# EAGLE design BenchTopPowerSupply (EAGLE 9.6.2)
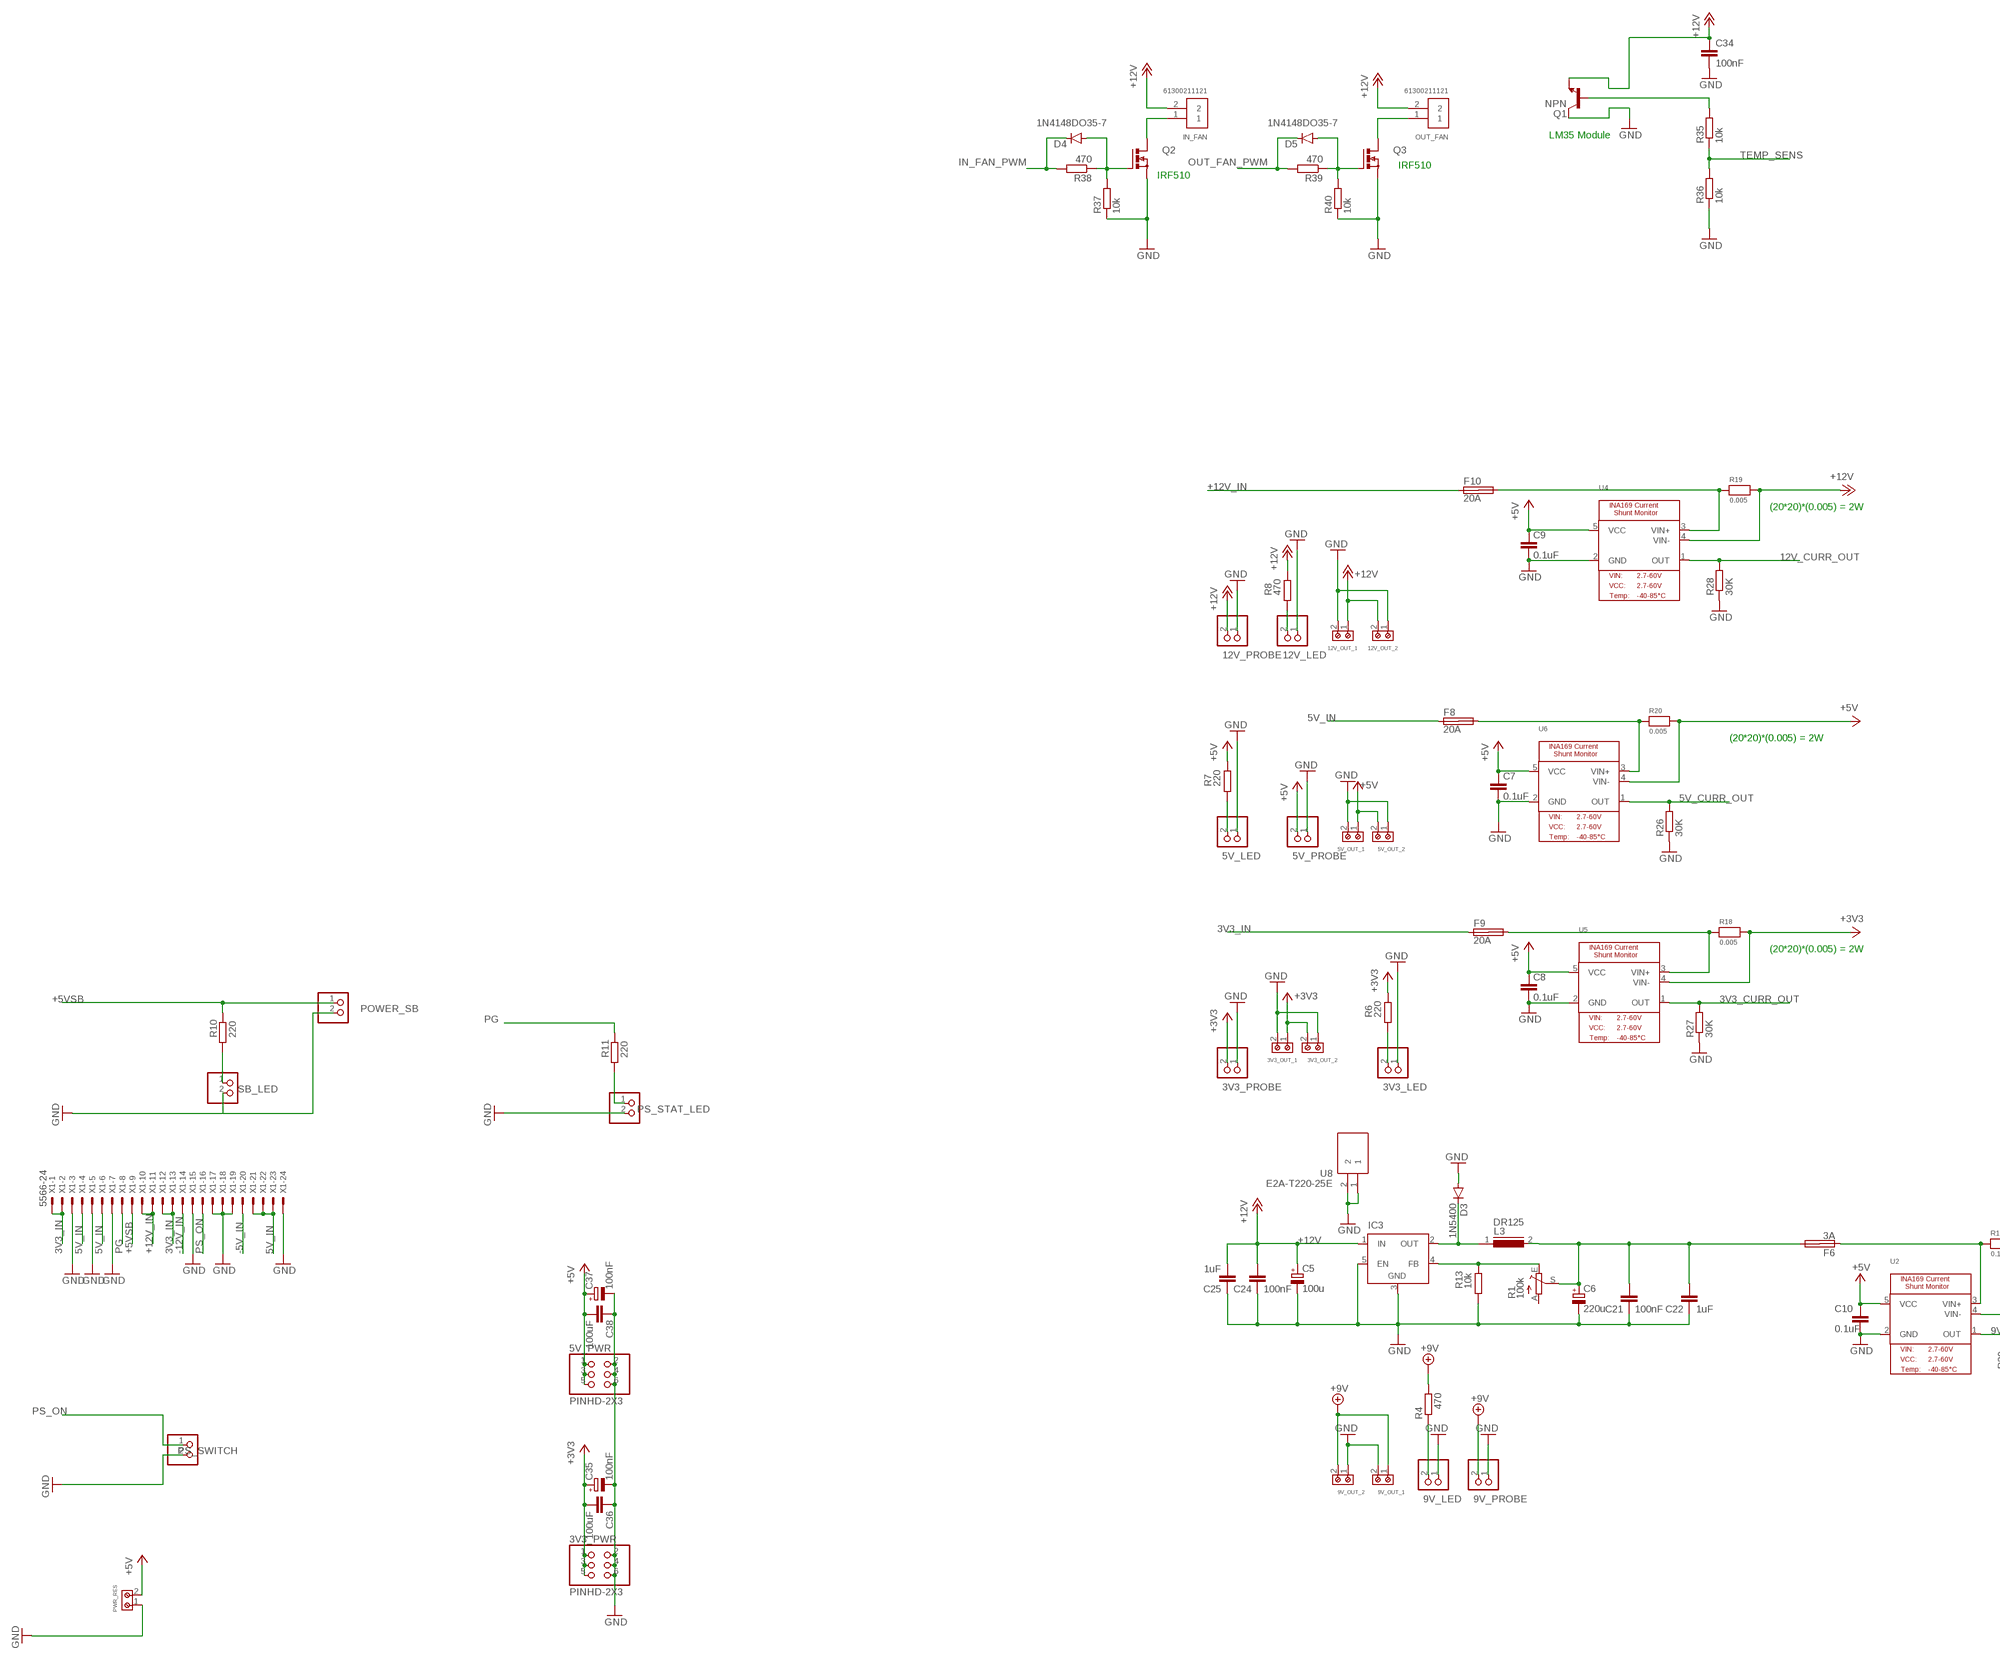
[diagram p0: schematic, sheet 1, part 1 of 2]
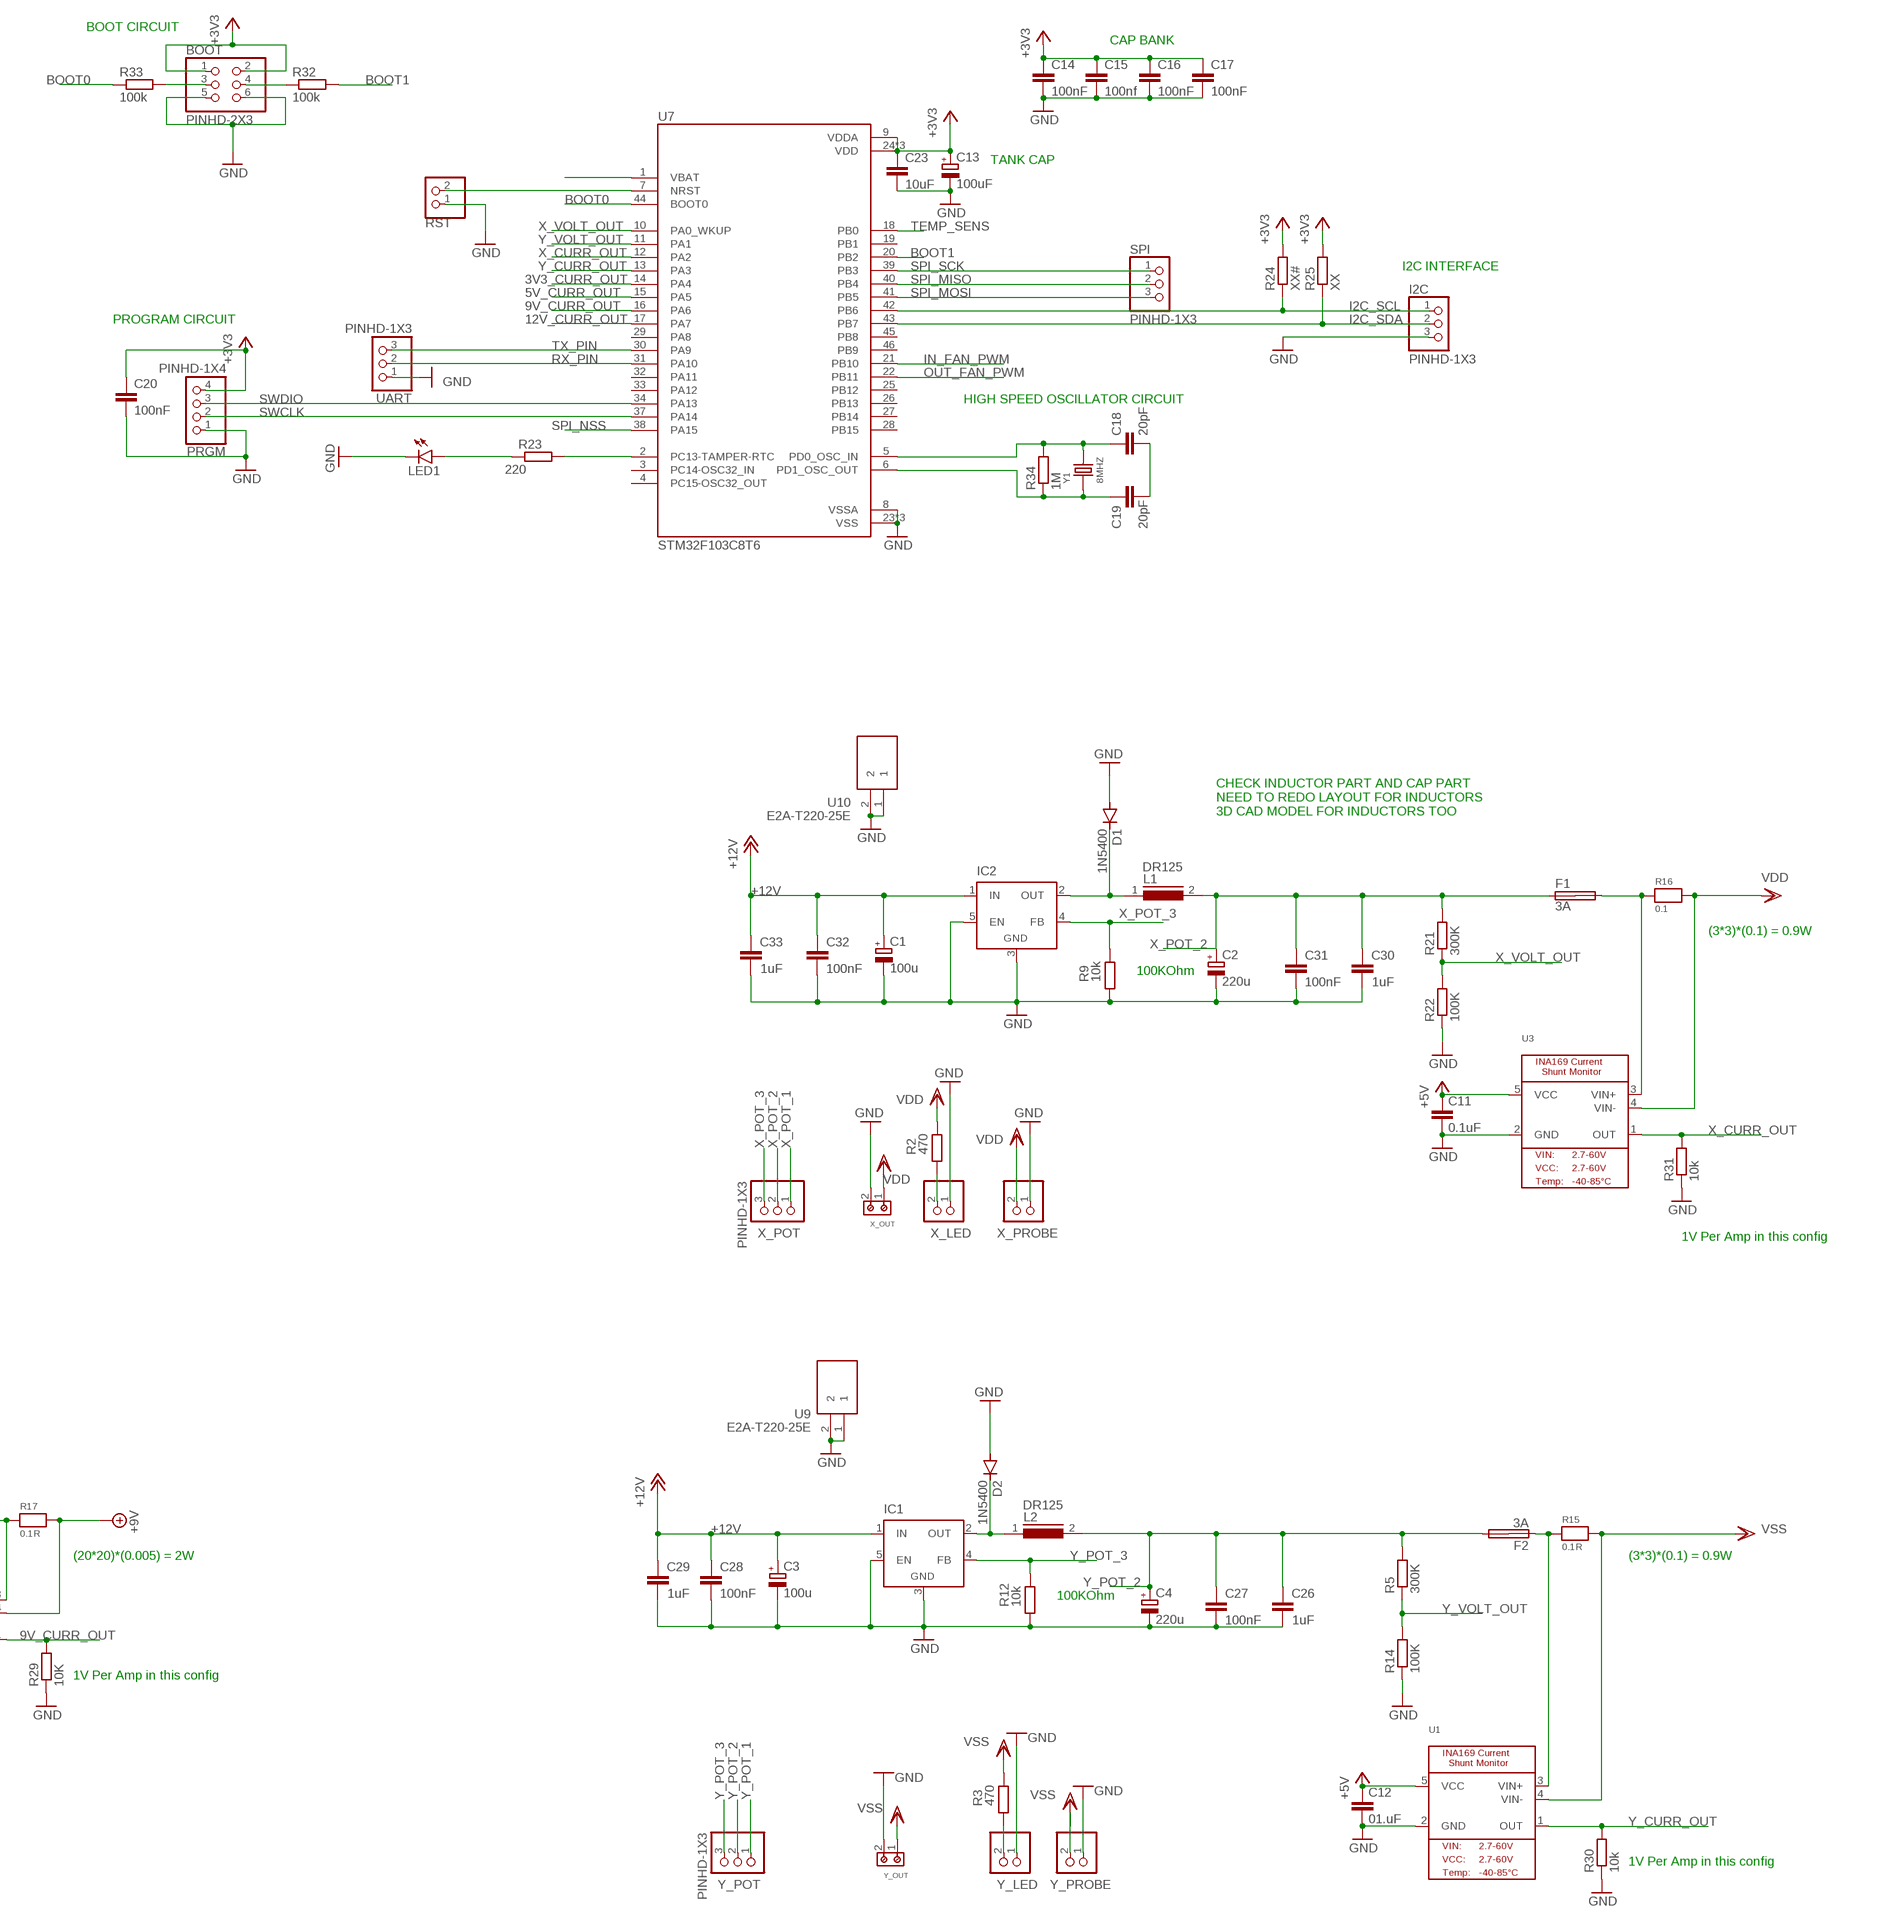
[diagram p1: schematic, sheet 1, part 2 of 2]

## Parts
3V3_LED  PINHD-1X2  [1X02]
3V3_OUT_1  691216510002S  [691216510002S]
3V3_OUT_2  691216510002S  [691216510002S]
3V3_PROBE  PINHD-1X2  [1X02]
3V3_PWR  PINHD-2X3  [2X03]
5V_LED  PINHD-1X2  [1X02]
5V_OUT_1  691216510002S  [691216510002S]
5V_OUT_2  691216510002S  [691216510002S]
5V_PROBE  PINHD-1X2  [1X02]
5V_PWR  PINHD-2X3  [2X03]
9V_LED  PINHD-1X2  [1X02]
9V_OUT_1  691216510002S  [691216510002S]
9V_OUT_2  691216510002S  [691216510002S]
9V_PROBE  PINHD-1X2  [1X02]
12V_LED  PINHD-1X2  [1X02]
12V_OUT_1  691216510002S  [691216510002S]
12V_OUT_2  691216510002S  [691216510002S]
12V_PROBE  PINHD-1X2  [1X02]
BOOT  PINHD-2X3  [2X03]
C1  100u  CPOL-EUE5-10.5  [E5-10,5]
C2  220u  CPOL-EUE5-10.5  [E5-10,5]
C3  100u  CPOL-EUE5-10.5  [E5-10,5]
C4  220u  CPOL-EUE5-10.5  [E5-10,5]
C5  100u  CPOL-EUE5-10.5  [E5-10,5]
C6  220u  CPOL-EUE5-10.5  [E5-10,5]
C7  0.1uF  C-EUC1206  [C1206]
C8  0.1uF  C-EUC1206  [C1206]
C9  0.1uF  C-EUC1206  [C1206]
C10  0.1uF  C-EUC1206  [C1206]
C11  0.1uF  C-EUC1206  [C1206]
C12  01.uF  C-EUC1206  [C1206]
C13  100uF  CPOL-EUE5-5  [E5-5]
C14  100nF  C-EUC1206  [C1206]
C15  100nf  C-EUC1206  [C1206]
C16  100nF  C-EUC1206  [C1206]
C17  100nF  C-EUC1206  [C1206]
C18  20pF  C-EUC1206  [C1206]
C19  20pF  C-EUC1206  [C1206]
C20  100nF  C-EUC1206  [C1206]
C21  100nF  C-EUC1206  [C1206]
C22  1uF  C-EUC1206  [C1206]
C23  10uF  C-EUC1206  [C1206]
C24  100nF  C-EUC1206  [C1206]
C25  1uF  C-EUC1206  [C1206]
C26  1uF  C-EUC1206  [C1206]
C27  100nF  C-EUC1206  [C1206]
C28  100nF  C-EUC1206  [C1206]
C29  1uF  C-EUC1206  [C1206]
C30  1uF  C-EUC1206  [C1206]
C31  100nF  C-EUC1206  [C1206]
C32  100nF  C-EUC1206  [C1206]
C33  1uF  C-EUC1206  [C1206]
C34  100nF  C-EUC1206  [C1206]
C35  100nF  CPOL-EUE5-5  [E5-5]
C36  100uF  C-EUC1206  [C1206]
C37  100nF  CPOL-EUE5-5  [E5-5]
C38  100uF  C-EUC1206  [C1206]
D1  1N5400  [DO201-15]
D2  1N5400  [DO201-15]
D3  1N5400  [DO201-15]
D4  1N4148DO35-7  [DO35-7]
D5  1N4148DO35-7  [DO35-7]
F1  3A  SHK20L  [SHK20L]
F2  3A  SHK20L  [SHK20L]
F6  3A  SHK20L  [SHK20L]
F8  20A  SHK20L  [SHK20L]
F9  20A  SHK20L  [SHK20L]
F10  20A  SHK20L  [SHK20L]
I2C  PINHD-1X3  [1X03]
IC1  LM2596TV  [TO220-51]
IC2  LM2596TV  [TO220-51]
IC3  LM2596TV  [TO220-51]
IN_FAN  61300211121  [61300211121]
L1  DR125  [DR125]
L2  DR125  [DR125]
L3  DR125  [DR125]
LED1  LED5MM  [LED5MM]
OUT_FAN  61300211121  [61300211121]
POWER_SB  PINHD-1X2  [1X02]
PRGM  PINHD-1X4  [1X04]
PS_STAT_LED  PINHD-1X2  [1X02]
PS_SWITCH  PINHD-1X2  [1X02]
PWR_RES  691216510002S  [691216510002S]
Q1  NPN  NPN_TO92  [TO92]
Q2  IRF510  IRF512  [TO220BV]
Q3  IRF510  IRF512  [TO220BV]
R1  100k  TRIM_EU-S64W  [S64W]
R2  470  R-EU_R1206  [R1206]
R3  470  R-EU_R1206  [R1206]
R4  470  R-EU_R1206  [R1206]
R5  300K  R-EU_R1206  [R1206]
R6  220  R-EU_R1206  [R1206]
R7  220  R-EU_R1206  [R1206]
R8  470  R-EU_R1206  [R1206]
R9  10k  R-EU_R1206  [R1206]
R10  220  R-EU_R1206  [R1206]
R11  220  R-EU_R1206  [R1206]
R12  10k  R-EU_R1206  [R1206]
R13  10k  R-EU_R1206  [R1206]
R14  100K  R-EU_R1206  [R1206]
R15  0.1R  MICROBUILDER_RESISTOR2512-OWN  [RESC6335X60N]
R16  0.1  MICROBUILDER_RESISTOR2512-OWN  [RESC6335X60N]
R17  0.1R  MICROBUILDER_RESISTOR2512-OWN  [RESC6335X60N]
R18  0.005  MICROBUILDER_RESISTOR2512-OWN  [RESC6335X60N]
R19  0.005  MICROBUILDER_RESISTOR2512-OWN  [RESC6335X60N]
R20  0.005  MICROBUILDER_RESISTOR2512-OWN  [RESC6335X60N]
R21  300K  R-EU_R1206  [R1206]
R22  100K  R-EU_R1206  [R1206]
R23  220  R-EU_R1206  [R1206]
R24  XX#  R-EU_R1206  [R1206]
R25  XX  R-EU_R1206  [R1206]
R26  30K  R-EU_R1206  [R1206]
R27  30K  R-EU_R1206  [R1206]
R28  30K  R-EU_R1206  [R1206]
R29  10K  R-EU_R1206  [R1206]
R30  10k  R-EU_R1206  [R1206]
R31  10k  R-EU_R1206  [R1206]
R32  100k  R-EU_R1206  [R1206]
R33  100k  R-EU_R1206  [R1206]
R34  1M  R-EU_R1206  [R1206]
R35  10k  R-EU_R1206  [R1206]
R36  10k  R-EU_R1206  [R1206]
R37  10k  R-EU_R1206  [R1206]
R38  470  R-EU_R1206  [R1206]
R39  470  R-EU_R1206  [R1206]
R40  10k  R-EU_R1206  [R1206]
RST  PINHD-1X2  [1X02]
SB_LED  PINHD-1X2  [1X02]
SPI  PINHD-1X3  [1X03]
U1  MICROBUILDER_INA1693D_PACKAGE  [SOT95P240X110-5N]
U2  MICROBUILDER_INA1693D_PACKAGE  [SOT95P240X110-5N]
U3  MICROBUILDER_INA1693D_PACKAGE  [SOT95P240X110-5N]
U4  MICROBUILDER_INA1693D_PACKAGE  [SOT95P240X110-5N]
U5  MICROBUILDER_INA1693D_PACKAGE  [SOT95P240X110-5N]
U6  MICROBUILDER_INA1693D_PACKAGE  [SOT95P240X110-5N]
U7  STM32F103C8T6  [QFP50P900X900X160-48N]
U8  E2A-T220-25E  [E2AT22025E]
U9  E2A-T220-25E  [E2AT22025E]
U10  E2A-T220-25E  [E2AT22025E]
UART  PINHD-1X3  [1X03]
X1  5566-24  [5566-24]
X_LED  PINHD-1X2  [1X02]
X_OUT  691216510002S  [691216510002S]
X_POT  PINHD-1X3  [1X03]
X_PROBE  PINHD-1X2  [1X02]
Y1  8MHZ  DIP-CRYSTAL-16MHZ-18PF-30PPM-40R(HC49US)  [HC49US]
Y_LED  PINHD-1X2  [1X02]
Y_OUT  691216510002S  [691216510002S]
Y_POT  PINHD-1X3  [1X03]
Y_PROBE  PINHD-1X2  [1X02]

## Nets
2B: F2.1A R15.1 U1.3(VIN+)
3V3_CURR_OUT: R27.2 U5.1(OUT) U7.14(PA4)
3V3_IN: F9.1A X1.1 X1.2 X1.12 X1.13
5V_CURR_OUT: R26.2 U6.1(OUT) U7.15(PA5)
5V_IN: F8.1A X1.4 X1.6 X1.21 X1.22 X1.23
9V_CURR_OUT: R29.2 U2.1(OUT) U7.16(PA6)
12V_CURR_OUT: R28.2 U4.1(OUT) U7.17(PA7)
+3V3: 3V3_OUT_1.1 3V3_OUT_2.2 3V3_PROBE.2 3V3_PWR.1 3V3_PWR.3 3V3_PWR.5 BOOT.1 BOOT.2 C13.+ C14.1 C15.1 C16.1 C17.1 C20.1 C23.1 C35.+ C36.2 PRGM.4 R6.2 R18.2 R24.2 R25.2 U5.4(VIN-) U7.9(VDDA) U7.24(VDD) U7.36(VDD) U7.48(VDD)
+5V: 5V_OUT_1.1 5V_OUT_2.2 5V_PROBE.2 5V_PWR.1 5V_PWR.3 5V_PWR.5 C7.1 C8.1 C9.1 C10.1 C11.1 C12.1 C37.+ C38.2 PWR_RES.2 R7.2 R20.2 U1.5(VCC) U2.5(VCC) U3.5(VCC) U4.5(VCC) U5.5(VCC) U6.4(VIN-) U6.5(VCC)
+5VSB: POWER_SB.1 R10.2 X1.9
+9V: 9V_OUT_1.1 9V_OUT_2.2 9V_PROBE.2 R4.2 R17.2 U2.4(VIN-)
+12V: 12V_OUT_1.1 12V_OUT_2.2 12V_PROBE.2 C1.+ C3.+ C5.+ C24.2 C25.2 C28.2 C29.2 C32.2 C33.2 C34.1 IC1.1(IN) IC2.1(IN) IC3.1(IN) IN_FAN.2 OUT_FAN.2 Q1.1(E) R8.2 R19.2 U4.4(VIN-)
+12V_IN: F10.1A X1.10 X1.11
-5V_IN: X1.20
-12V_IN: X1.14
BOOT0: R33.1 U7.44(BOOT0)
BOOT1: R32.2 U7.20(PB2)
GND: 3V3_LED.1 3V3_OUT_1.2 3V3_OUT_2.1 3V3_PROBE.1 3V3_PWR.2 3V3_PWR.4 3V3_PWR.6 5V_LED.1 5V_OUT_1.2 5V_OUT_2.1 5V_PROBE.1 5V_PWR.2 5V_PWR.4 5V_PWR.6 9V_LED.1 9V_OUT_1.2 9V_OUT_2.1 9V_PROBE.1 12V_LED.1 12V_OUT_1.2 12V_OUT_2.1 12V_PROBE.1 BOOT.5 BOOT.6 C1.- C2.- C3.- C4.- C5.- C6.- C7.2 C8.2 C9.2 C10.2 C11.2 C12.2 C13.- C14.2 C15.2 C16.2 C17.2 C20.2 C21.1 C22.1 C23.2 C24.1 C25.1 C26.1 C27.1 C28.1 C29.1 C30.1 C31.1 C32.1 C33.1 C34.2 C35.- C36.1 C37.- C38.1 D1.A D2.A D3.A I2C.3 IC1.3(GND) IC1.5(EN) IC2.3(GND) IC2.5(EN) IC3.3(GND) IC3.5(EN) LED1.K(C) POWER_SB.2 PRGM.1 PS_STAT_LED.2 PS_SWITCH.2 PWR_RES.1 Q1.3(C) Q2.S Q3.S R9.1 R12.1 R13.1 R14.1 R22.1 R26.1 R27.1 R28.1 R29.1 R30.1 R31.1 R36.1 R37.1 R40.1 RST.1 SB_LED.2 U1.2(GND) U2.2(GND) U3.2(GND) U4.2(GND) U5.2(GND) U6.2(GND) U7.8(VSSA) U7.23(VSS) U7.35(VSS) U7.47(VSS) U8.1 U8.2 U9.1 U9.2 U10.1 U10.2 UART.1 X1.3 X1.5 X1.7 X1.15 X1.17 X1.18 X1.19 X1.24 X_LED.1 X_OUT.2 X_PROBE.1 Y_LED.1 Y_OUT.2 Y_PROBE.1
I2C_SCL: I2C.1 R24.1 U7.42(PB6)
I2C_SDA: I2C.2 R25.1 U7.43(PB7)
IN_FAN_PWM: D4.C R38.2 U7.21(PB10)
N$1: D3.C IC3.2(OUT) L3.1
N$2: IC3.4(FB) R1.E R13.2
N$3: C18.1 R34.2 U7.5(PD0_OSC_IN) Y1.2
N$4: D1.C IC2.2(OUT) L1.1
N$5: C19.1 R34.1 U7.6(PD1_OSC_OUT) Y1.1
N$6: F8.2A R20.1 U6.3(VIN+)
N$7: R3.1 Y_LED.2
N$8: R2.1 X_LED.2
N$9: 9V_LED.2 R4.1
N$10: C18.2 C19.2
N$11: 3V3_LED.2 R6.1
N$12: 5V_LED.2 R7.1
N$13: 12V_LED.2 R8.1
N$14: R10.1 SB_LED.1
N$15: PS_STAT_LED.1 R11.1
N$16: BOOT.4 R32.1
N$17: C6.+ C21.2 C22.2 F6.2A L3.2 R1.S
N$18: D2.C IC1.2(OUT) L2.1
N$19: F9.2A R18.1 U5.3(VIN+)
N$20: F1.2A R16.1 U3.3(VIN+)
N$21: F10.2A R19.1 U4.3(VIN+)
N$22: U7.1(VBAT)
N$23: F6.1A R17.1 U2.3(VIN+)
N$25: RST.2 U7.7(NRST)
N$26: Q1.2(B) R35.2
N$27: R23.2 U7.2(PC13-TAMPER-RTC)
N$28: LED1.A R23.1
N$29: BOOT.3 R33.2
N$30: D4.A Q2.G R37.2 R38.1
N$31: IN_FAN.1 Q2.D
N$32: D5.A Q3.G R39.1 R40.2
N$35: OUT_FAN.1 Q3.D
OUT_FAN_PWM: D5.C R39.2 U7.22(PB11)
PG: R11.2 X1.8
PS_ON: PS_SWITCH.1 X1.16
RX_PIN: U7.31(PA10) UART.2
SPI_MISO: SPI.2 U7.40(PB4)
SPI_MOSI: SPI.3 U7.41(PB5)
SPI_NSS: U7.38(PA15)
SPI_SCK: SPI.1 U7.39(PB3)
SWCLK: PRGM.2 U7.37(PA14)
SWDIO: PRGM.3 U7.34(PA13)
TEMP_SENS: R35.1 R36.2 U7.18(PB0)
TX_PIN: U7.30(PA9) UART.3
VDD: R2.2 R16.2 U3.4(VIN-) X_OUT.1 X_PROBE.2
VSS: R3.2 R15.2 U1.4(VIN-) Y_OUT.1 Y_PROBE.2
X_CURR_OUT: R31.2 U3.1(OUT) U7.12(PA2)
X_POT_1: X_POT.1
X_POT_2: C2.+ C30.2 C31.2 F1.1A L1.2 R21.2 X_POT.2
X_POT_3: IC2.4(FB) R9.2 X_POT.3
X_VOLT_OUT: R21.1 R22.2 U7.10(PA0_WKUP)
Y_CURR_OUT: R30.2 U1.1(OUT) U7.13(PA3)
Y_POT_1: Y_POT.1
Y_POT_2: C4.+ C26.2 C27.2 F2.2A L2.2 R5.2 Y_POT.2
Y_POT_3: IC1.4(FB) R12.2 Y_POT.3
Y_VOLT_OUT: R5.1 R14.2 U7.11(PA1)
Unconnected: F1.1B F1.2B F2.1B F2.2B F6.1B F6.2B F8.1B F8.2B F9.1B F9.2B F10.1B F10.2B R1.A U7.3(PC14-OSC32_IN) U7.4(PC15-OSC32_OUT) U7.19(PB1) U7.25(PB12) U7.26(PB13) U7.27(PB14) U7.28(PB15) U7.29(PA8) U7.32(PA11) U7.33(PA12) U7.45(PB8) U7.46(PB9)

## Notes on the sheet
- BOOT CIRCUIT
- CAP BANK
- LM35 Module
- IRF510
- IRF510
- TANK CAP
- I2C INTERFACE
- PROGRAM CIRCUIT
- HIGH SPEED OSCILLATOR CIRCUIT
- (20*20)*(0.005) = 2W
- CHECK INDUCTOR PART AND CAP PART
  NEED TO REDO LAYOUT FOR INDUCTORS
  3D CAD MODEL FOR INDUCTORS TOO
- (20*20)*(0.005) = 2W
- (3*3)*(0.1) = 0.9W
- 100KOhm
- (20*20)*(0.005) = 2W
- 1V Per Amp in this config
- (20*20)*(0.005) = 2W | (3*3)*(0.1) = 0.9W
- 100KOhm
- 1V Per Amp in this config
- 1V Per Amp in this config

## Library data of the parts
3V3_LED 3V3_PROBE 5V_LED 5V_PROBE 9V_LED 9V_PROBE 12V_LED 12V_PROBE POWER_SB PS_STAT_LED PS_SWITCH RST SB_LED X_LED X_PROBE Y_LED Y_PROBE = pinhead:PINHD-1X2: PIN HEADER
3V3_OUT_1 3V3_OUT_2 5V_OUT_1 5V_OUT_2 9V_OUT_1 9V_OUT_2 12V_OUT_1 12V_OUT_2 PWR_RES X_OUT Y_OUT = Wurth_Connectors_WR-TBL Rising Cage Clamp:691216510002S: WR-TBL Serie 2165S - 5.08 mm Horizontal Entry Modular w. Rising Cage Clamp KIND PROPERTIES Pitch 5.08 mm MATERIAL PROPERTIES Insulator Material PA66 Insulator Flammability Rating UL94 V-0 Contact Material Copper Alloy Contact Plating Tin over Nickel Contact Type Stamped Terminal Screw Material Steel Terminal Screw Plating Zinc Wire Guard Material Copper Alloy GENERAL INFORMATION Operating Temperature -30 up to +120 °C Compliance ROHS & Reach ELECTRICAL PROPERTIES IR UL 14 A IR VDE 24 A Working Voltage [UL] 300 V (AC) Working Voltage [VDE] 250 V (AC) Withstanding Voltage [UL] 1600 V (AC) Withstanding Voltage [VDE] 2000 V (AC) Contact Resistance 20 mΩ MECHANICAL PROPERTIES Wire Strip Length 6 Screw M3 CERTIFICATION UL Approval E150931 VDE Approval 40021356 PACKAGING PROPERTIES Packaging Box <https://www.we-online.com/catalog/media/o55598v209%20Family_Con_TBL_Screw_RisingClamp_5.08_6912165100xxS.psd.jpg> Details see: https://www.we-online.com/catalog/en/TBL_5_08_2165S_HORIZONTAL_ENTRY_W_RISING_CAGE_69121351000xS/ Updated by Ella Wu 2019-11-26 2019(C) Wurth Elektronik; IR-UL: 14A; IR-VDE: 24A; PART-NUMBER: 691216510002S; PINS: 2; PITCH: 5.08mm; TYPE: Horizontal; WIRE: 12 to 30 (AWG) 3.31 to 0.0509 (mm²); WORKING-VOLTAGE-UL: 300V (AC); WORKING-VOLTAGE-VDE: 250V (AC)
3V3_PWR 5V_PWR BOOT = Connector:PINHD-2X3: PIN HEADER; CATEGORY: CONNECTOR; SUB-CATEGORY: PIN-HEADER
C1-C6 C13 C35 C37 = rcl:CPOL-EU: POLARIZED CAPACITOR, European symbol; SPICEPREFIX: C
C7-C12 C14-C34 C36 C38 = rcl:C-EU: CAPACITOR, European symbol; SPICEPREFIX: C
D1-D3 = diode:1N5400: DIODE standard rectifier, 3 A, 50 V (Motorola)
D4 D5 = diode:1N4148: DIODE high speed (Philips)
F1 F2 F6 F8-F10 = fuse:SHK20L: FUSE HOLDER 5 x 20 mm, SH contact, SHH1 Schukat, E1073 Buerklin; OC_FARNELL: unknown; OC_NEWARK: unknown
I2C SPI UART X_POT Y_POT = Connector:PINHD-1X3: PIN HEADER; CATEGORY: CONNECTOR; SUB-CATEGORY: PIN-HEADER
IC1-IC3 = linear:LM2596T: STEP-DOWN VOLTAGE REGULATOR
IN_FAN OUT_FAN = Headers:61300211121: CONN HEADER VERT 2POS 2.54MM Manufacturer's datasheet <https://katalog.we-online.de/em/datasheet/6130xx11121.pdf>; CREATED_BY: PCBLayout.com; DIGI_KEY_PART_NUMBER: 732-5315-ND; MANUFACTURER: Wurth Electronics Inc.; MPN: 61300211121
L1-L3 = inductors:DR125: High Power Density, High Efficiency, Shielded Inductors Source: coiltronics_dr_series.pdf; SPICEPREFIX: L
LED1 = led:LED: LED OSRAM: - CHIPLED LG R971, LG N971, LY N971, LG Q971, LY Q971, LO R971, LY R971 LH N974, LH R974 LS Q976, LO Q976, LY Q976 LO Q996 - Hyper CHIPLED LW Q18S LB Q993, LB Q99A, LB R99A - SideLED LS A670, LO A670, LY A670, LG A670, LP A670 LB A673, LV A673, LT A673, LW A673 LH A674 LY A675 LS A676, LA A676, LO A676, LY A676, LW A676 LS A679, LY A679, LG A679 - Hyper Micro SIDELED® LS Y876, LA Y876, LO Y876, LY Y876 LT Y87S - SmartLED LW L88C, LW L88S LB L89C, LB L89S, LG L890 LS L89K, LO L89K, LY L89K LS L896, LA L896, LO L896, LY L896 - TOPLED LS T670, LO T670, LY T670, LG T670, LP T670 LSG T670, LSP T670, LSY T670, LOP T670, LYG T670 LG T671, LOG T671, LSG T671 LB T673, LV T673, LT T673, LW T673 LH T674 LS T676, LA T676, LO T676, LY T676, LB T676, LH T676, LSB T676, LW T676 LB T67C, LV T67C, LT T67C, LS T67K, LO T67K, LY T67K, LW E67C LS E67B, LA E67B, LO E67B, LY E67B, LB E67C, LV E67C, LT E67C LW T67C LS T679, LY T679, LG T679 LS T770, LO T770, LY T770, LG T770, LP T770 LB T773, LV T773, LT T773, LW T773 LH T774 LS E675, LA E675, LY E675, LS T675 LS T776, LA T776, LO T776, LY T776, LB T776 LHGB T686 LT T68C, LB T68C - Hyper Mini TOPLED® LB M676 - Mini TOPLED Santana® LG M470 LS M47K, LO M47K, LY M47K Source: http://www.osram.convergy.de LUXEON: - LUMILED® LXK2-PW12-R00, LXK2-PW12-S00, LXK2-PW14-U00, LXK2-PW14-V00 LXK2-PM12-R00, LXK2-PM12-S00, LXK2-PM14-U00 LXK2-PE12-Q00, LXK2-PE12-R00, LXK2-PE12-S00, LXK2-PE14-T00, LXK2-PE14-U00 LXK2-PB12-K00, LXK2-PB12-L00, LXK2-PB12-M00, LXK2-PB14-N00, LXK2-PB14-P00, LXK2-PB14-Q00 LXK2-PR12-L00, LXK2-PR12-M00, LXK2-PR14-Q00, LXK2-PR14-R00 LXK2-PD12-Q00, LXK2-PD12-R00, LXK2-PD12-S00 LXK2-PH12-R00, LXK2-PH12-S00 LXK2-PL12-P00, LXK2-PL12-Q00, LXK2-PL12-R00 Source: www.luxeon.com KINGBRIGHT: KA-3528ASYC Source: www.kingbright.com
PRGM = Connector:PINHD-1X4: PIN HEADER; CATEGORY: CONNECTOR; SUB-CATEGORY: PIN-HEADER
Q1 = Transistor:NPN: NPN - Generic; CATEGORY: Transistor; SUB-CATEGORY: BJT; TYPE: NPN
Q2 Q3 = transistor-power:IRF512: N-CHANNEL MOS FET
R1 = pot:TRIM_EU-: POTENTIOMETER
R2-R14 R21-R40 = rcl:R-EU_: RESISTOR, European symbol; SPICEPREFIX: R
R15-R20 = Adafruit INA169 CurPowerMonitor:MICROBUILDER_RESISTOR: Resistors For new designs, use the packages preceded by an '_' character since they are more reliable: The following footprints should be used on most boards: _0402 - Standard footprint for regular board layouts _0603 - Standard footprint for regular board layouts _0805 - Standard footprint for regular board layouts For extremely tight-pitch boards where space is at a premium, the following 'micro-pitch' footprints can be used (smaller pads, no silkscreen outline, etc.): _0402MP - Micro-pitch footprint for very dense/compact boards _0603MP - Micro-pitch footprint for very dense/compact boards _0805MP - Micro-pitch footprint for very dense/compact boards
U1-U6 = Adafruit INA169 CurPowerMonitor:MICROBUILDER_INA169: INA169 - High-Side Measurement Current Shunt Monitor The device converts a differential input voltage to a current output. This current is converted back to a voltage with an external load resistor that sets any gain from 1 to over 100.
U7 = STM32F103C8T6:STM32F103C8T6: Mainstream Performance line, ARM Cortex-M3 MCU with 64 Kbytes Flash, 72 MHz CPU, motor control, USB and CAN Check prices <https://pricing.snapeda.com/search/part/STM32F103C8T6/?ref=eda>; AVAILABILITY: Good; DESCRIPTION: ARM® Cortex®-M3 STM32F1 Microcontroller IC 32-Bit 72MHz 64KB (64K x 8) FLASH 48-LQFP (7x7); MF: STMicroelectronics; MP: STM32F103C8T6; PACKAGE: LQFP-48 STMicroelectronics; PRICE: None; PURCHASE-URL: https://pricing.snapeda.com/search/part/STM32F103C8T6/?ref=eda
U8-U10 = SamacSys_Parts:E2A-T220-25E: OHMITE - E2A-T220-25E - HEAT SINK, ALUM ALLOY, 16.3MM, TO-220 Source: Datasheet <https://www.ohmite.com/assets/docs/sink_ex.pdf?r=false>; ARROW_PART_NUMBER: E2A-T220-25E; DESCRIPTION: OHMITE - E2A-T220-25E - HEAT SINK, ALUM ALLOY, 16.3MM, TO-220; HEIGHT: 25.4mm; MANUFACTURER_NAME: Ohmite; MANUFACTURER_PART_NUMBER: E2A-T220-25E; MOUSER_PART_NUMBER: 588-E2A-T220-25E; MOUSER_PRICE-STOCK: https://www.mouser.co.uk/ProductDetail/Ohmite/E2A-T220-25E?qs=Ey4jopcCj2q8O3LMZTmuTA%3D%3D
X1 = con-molex:5566-24: Mini FIT connector 24 pol Source: http://www.molex.com; MF: MOLEX; OC_FARNELL: unknown; OC_NEWARK: unknown
Y1 = OPL_Crystal Oscillator:DIP-CRYSTAL-16MHZ-18PF-30PPM-40R(HC49US): 306010014; MPN: HC-49US 16.000MHz; VALUE: 16MHZ

## Module HEATSINK
Ports: 

### Library data of the parts

## Module LM35
Ports: 

### Library data of the parts

## Board
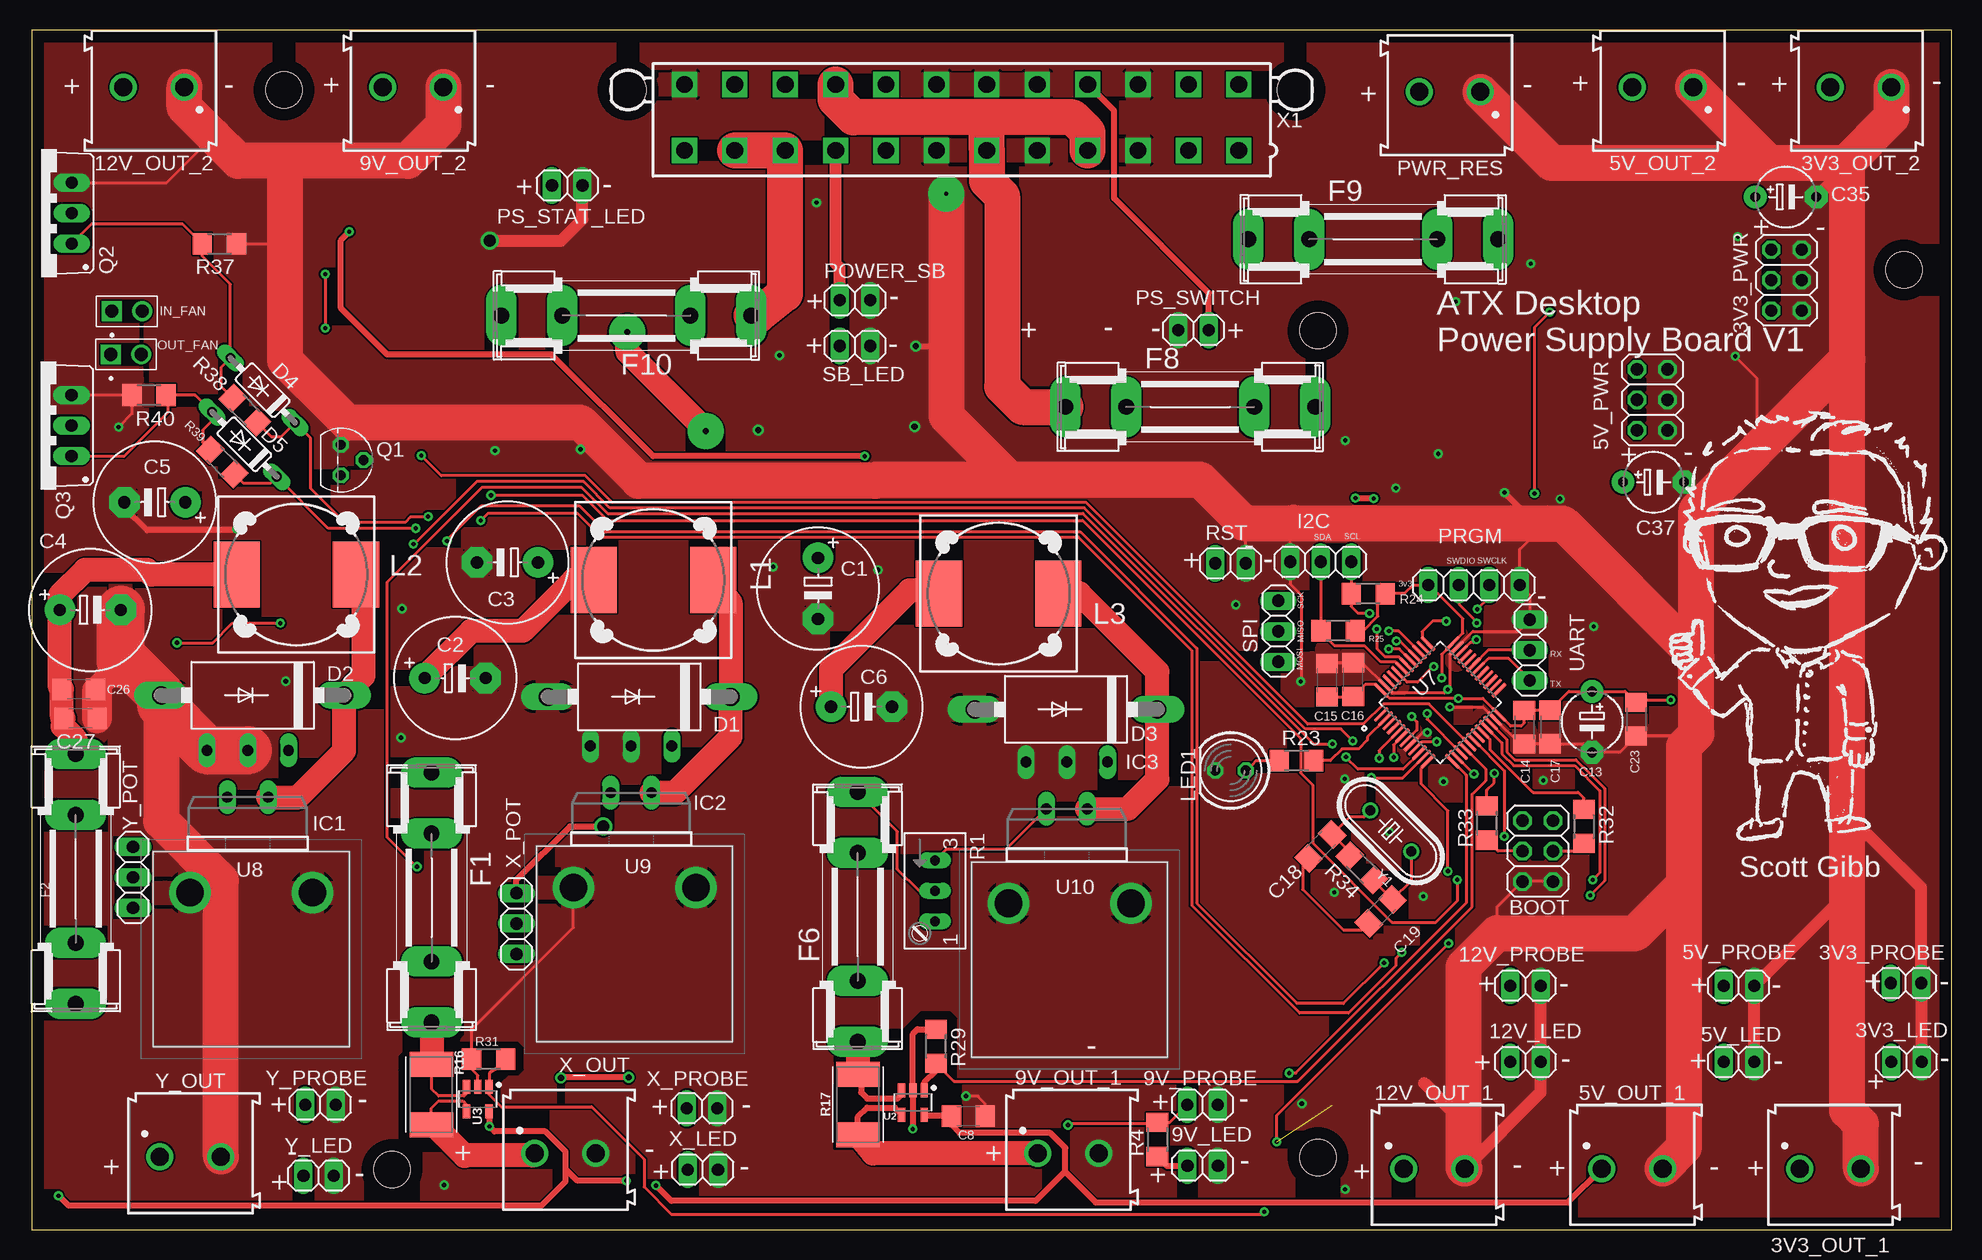
[diagram p2: board, top side]
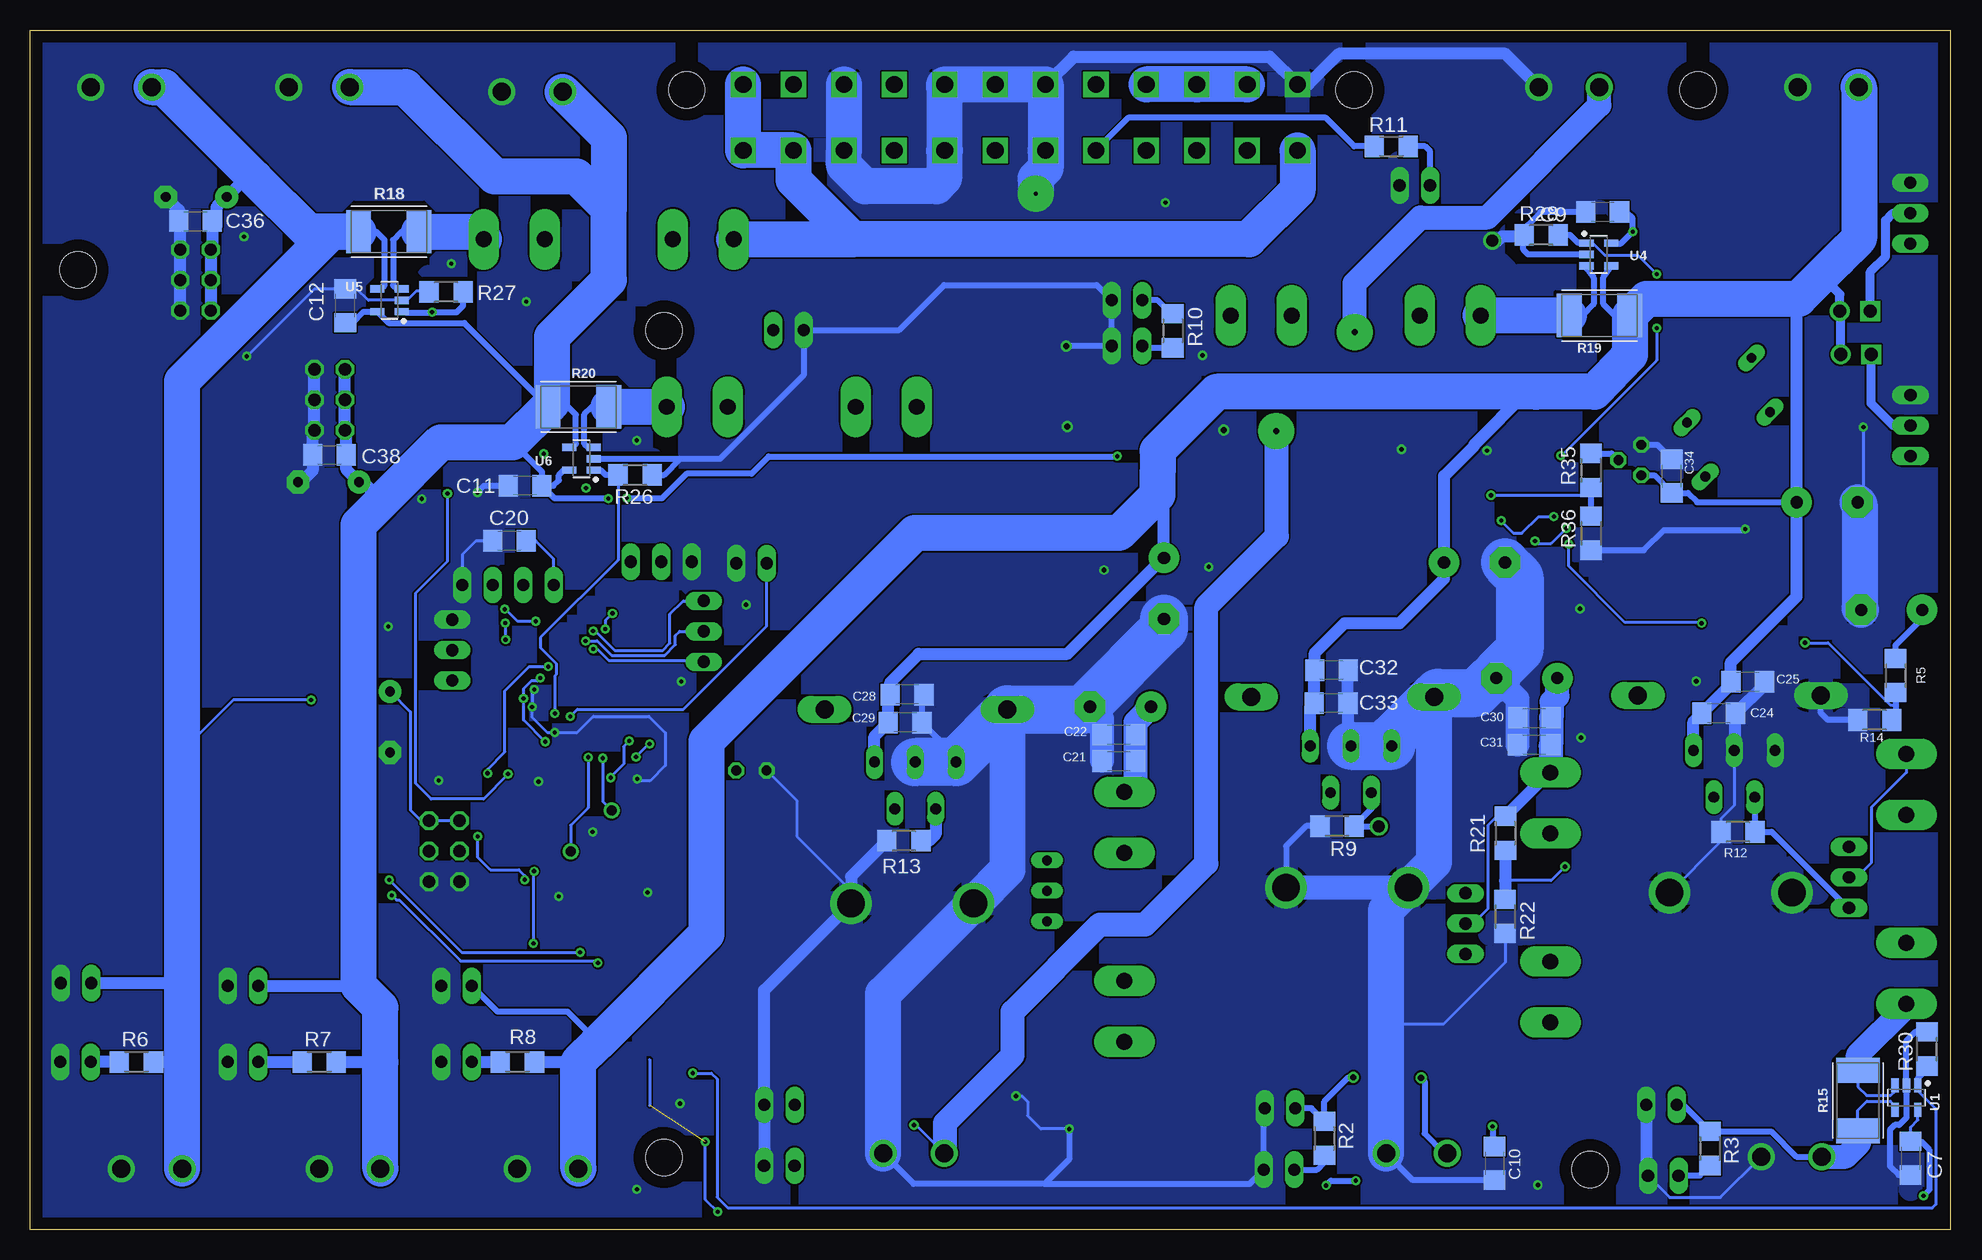
[diagram p3: board, bottom side, seen from below]

Size 160 x 100 mm. Coordinates in mm from the lower left corner, seen from the top.
Outline: 0,0 160,0 160,100 0,100 0,0
Copper layers (1*16): Top 0.035mm / dielectric 1.5mm / Bottom 0.035mm
Design rules "default *": minimum track width 6mil, minimum drill 0.35mm, track to track 6mil, track to pad 6mil, pad to pad 6mil, via to via 6mil, smd to smd 6mil, copper to edge 40mil, drill to drill 6mil, minimum pad ring 10mil, minimum via ring 8mil, stop-mask expansion 4mil, vias tented up to drill 0mil, thermal gap 10mil
Holes 3 mm at 30,5 107.16,6 107.16,74.93 21,95 156,80

### Footprints (pad centres in the part's own frame; a part is rotated, then mirrored left to right if it is on the bottom)
1X02 = drill 1.016 long: 1 -1.27,0; 2 1.27,0
691216510002S = drill 1.5: 1 -2.54,0; 2 2.54,0
2X03 = drill 1.016 octagon: 1 -2.54,-1.27; 2 -2.54,1.27; 3 0,-1.27; 4 0,1.27; 5 2.54,-1.27; 6 2.54,1.27
E5-10,5 = drill 1.016 pad 2.54: + -2.54,0 | drill 1.016 pad 2.54 octagon: - 2.54,0
C1206 = smd 1.6 x 1.8: 1 -1.4,0; 2 1.4,0
E5-5 = drill 0.813 pad 1.905: + -2.54,0 | drill 0.813 pad 1.905 octagon: - 2.54,0
DO201-15 = drill 1.499 long: A 7.62,0; C -7.62,0
DO35-7 = drill 0.813 long: A 3.81,0; C -3.81,0
SHK20L = drill 1.321 pad 2.54 long: 1A -10.414,0; 1B -5.334,0; 2A 10.414,0; 2B 5.334,0
1X03 = drill 1.016 long: 1 -2.54,0; 2 0,0; 3 2.54,0
TO220-51 = drill 0.9 long: 1 -3.4,-8.4; 2 -1.7,-4.5; 3 0,-8.4; 4 1.7,-4.5; 5 3.4,-8.4
61300211121 = drill 1.1 square: 1 -1.27,0 | drill 1.1: 2 1.27,0
DR125 = smd 3.85 x 5.5: 1 -4.975,0; 2 4.975,0
LED5MM = drill 0.813 octagon: A -1.27,0; K 1.27,0
1X04 = drill 1.016 long: 1 -3.81,0; 2 -1.27,0; 3 1.27,0; 4 3.81,0
TO92 = drill 0.813 octagon: 1 1.27,0; 2 0,1.905; 3 -1.27,0
TO220BV = drill 1.016 long: D 0,-2.54; G -2.54,-2.54; S 2.54,-2.54
S64W = drill 0.813 long: A 2.54,1.27; E -2.54,1.27; S 0,1.27
R1206 = smd 1.6 x 1.803: 1 -1.422,0; 2 1.422,0
RESC6335X60N = smd 2.062 x 3.612: 1 -2.525,0; 2 2.525,0
SOT95P240X110-5N = smd 1.18 x 0.609: 1 -1.024,0.95; 2 -1.024,0; 3 -1.024,-0.95; 4 1.024,-0.95; 5 1.024,0.95
QFP50P900X900X160-48N = smd 1.56 x 0.28: 1 -4.18,2.75; 2 -4.18,2.25; 3 -4.18,1.75; 4 -4.18,1.25; 5 -4.18,0.75; 6 -4.18,0.25; 7 -4.18,-0.25; 8 -4.18,-0.75; 9 -4.18,-1.25; 10 -4.18,-1.75; 11 -4.18,-2.25; 12 -4.18,-2.75; 25 4.18,-2.75; 26 4.18,-2.25; 27 4.18,-1.75; 28 4.18,-1.25; 29 4.18,-0.75; 30 4.18,-0.25; 31 4.18,0.25; 32 4.18,0.75; 33 4.18,1.25; 34 4.18,1.75; 35 4.18,2.25; 36 4.18,2.75 | smd 0.28 x 1.56: 13 -2.75,-4.18; 14 -2.25,-4.18; 15 -1.75,-4.18; 16 -1.25,-4.18; 17 -0.75,-4.18; 18 -0.25,-4.18; 19 0.25,-4.18; 20 0.75,-4.18; 21 1.25,-4.18; 22 1.75,-4.18; 23 2.25,-4.18; 24 2.75,-4.18; 37 2.75,4.18; 38 2.25,4.18; 39 1.75,4.18; 40 1.25,4.18; 41 0.75,4.18; 42 0.25,4.18; 43 -0.25,4.18; 44 -0.75,4.18; 45 -1.25,4.18; 46 -1.75,4.18; 47 -2.25,4.18; 48 -2.75,4.18
E2AT22025E = drill 2.3 pad 3.45: 1 0,0; 2 0,10.2
5566-24 = drill 1.4 square: 1 23.1,-2.75; 2 18.9,-2.75; 3 14.7,-2.75; 4 10.5,-2.75; 5 6.3,-2.75; 6 2.1,-2.75; 7 -2.1,-2.75; 8 -6.3,-2.75; 9 -10.5,-2.75; 10 -14.7,-2.75; 11 -18.9,-2.75; 12 -23.1,-2.75; 13 23.1,2.75; 14 18.9,2.75; 15 14.7,2.75; 16 10.5,2.75; 17 6.3,2.75; 18 2.1,2.75; 19 -2.1,2.75; 20 -6.3,2.75; 21 -10.5,2.75; 22 -14.7,2.75; 23 -18.9,2.75; 24 -23.1,2.75 | hole 3: 27.8,2.29; -27.8,2.29
HC49US = drill 0.813: 1 -2.413,0; 2 2.413,0

### Placement (x,y rotation side)
3V3_LED  156.21,13.97 180 top
3V3_OUT_1  149.86,5.08 0 top
3V3_OUT_2  152.4,95.25 180 top
3V3_PROBE  156.16,20.55 180 top
3V3_PWR  146.2,79.15 270 top
5V_LED  142.24,13.97 180 top
5V_OUT_1  133.35,5.08 0 top
5V_OUT_2  135.89,95.25 180 top
5V_PROBE  142.24,20.32 180 top
5V_PWR  135.03,69.16 270 top
9V_LED  97.56,5.32 180 top
9V_OUT_1  86.36,6.35 0 top
9V_OUT_2  31.75,95.25 180 top
9V_PROBE  97.55,10.4 180 top
12V_LED  124.46,13.97 180 top
12V_OUT_1  116.84,5.08 0 top
12V_OUT_2  10.16,95.25 180 top
12V_PROBE  124.46,20.32 180 top
BOOT  125.48,31.55 270 top
C1  65.51,53.44 270 top
C2  35.27,45.97 0 top
C3  39.62,55.61 180 top
C4  4.86,51.65 0 top
C5  10.24,60.63 180 top
C6  69.13,43.59 0 top
C7  3.29,5.94 270 bottom
C8  78.03,9.47 0 top
C9  28.94,84.82 180 bottom
C10  37.96,5.52 270 bottom
C11  118.75,62 180 bottom
C12  133.73,77.01 90 bottom
C13  130,42.32 270 top
C14  124.36,41.87 270 top
C15  107.92,45.8 90 top
C16  110.11,45.85 90 top
C17  126.52,41.9 270 top
C18  107.37,31.94 225 top
C19  112.38,26.52 225 top
C20  120.04,57.4 180 bottom
C21  69.27,39.07 0 bottom
C22  69.27,41.26 0 bottom
C23  133.68,42.55 270 top
C24  19.28,43.03 180 bottom
C25  16.85,45.66 180 bottom
C26  3.89,45.03 180 top
C27  4.04,42.61 180 top
C28  86.91,44.59 180 bottom
C29  87.07,42.27 180 bottom
C30  34.63,42.66 0 bottom
C31  34.66,40.42 0 bottom
C32  51.54,46.62 180 bottom
C33  51.57,43.88 180 bottom
C34  23.19,62.81 90 bottom
C35  146.15,86.08 0 top
C36  146.2,84.07 0 bottom
C37  135.13,62.31 0 top
C38  135.04,64.58 0 bottom
D1  50.61,44.41 180 top
D2  18.39,44.54 180 top
D3  86.17,43.36 180 top
D4  19.23,69.96 135 top
D5  17.7,65.46 135 top
F1  33.3,27.67 270 top
F2  3.64,29.24 90 top
F6  68.81,26.07 90 top
F8  96.52,68.58 0 top
F9  111.76,82.55 0 top
F10  49.53,76.2 180 top
I2C  107.39,55.66 180 top
IC1  17.98,31.55 180 top
IC2  49.92,31.92 180 top
IC3  86.23,30.57 180 top
IN_FAN  7.91,76.56 0 top
L1  51.79,54.15 180 top
L2  22.03,54.6 180 top
L3  80.56,53.02 180 top
LED1  99.89,38.27 180 top
OUT_FAN  7.84,72.96 0 top
POWER_SB  68.58,77.47 0 top
PRGM  120.17,53.72 180 top
PS_STAT_LED  44.6,87.05 0 top
PS_SWITCH  96.8,74.98 180 top
PWR_RES  118.16,94.84 180 top
Q1  25.73,64.15 270 top
Q2  0.77,84.72 90 top
Q3  0.75,67.03 90 top
R1  73.98,28.23 270 top
R2  52.13,7.61 90 bottom
R3  20,6.76 90 bottom
R4  93.78,7.51 90 top
R5  4.53,46.19 90 bottom
R6  151.13,13.97 0 bottom
R7  135.89,13.97 0 bottom
R8  119.38,13.97 0 bottom
R9  51.08,33.63 0 bottom
R10  64.77,74.93 90 bottom
R11  46.56,90.3 180 bottom
R12  17.67,33.15 0 bottom
R13  87.17,32.41 0 bottom
R14  6.27,42.48 0 bottom
R15  7.67,10.74 270 bottom
R16  33.29,11.25 270 top
R17  68.83,10.41 270 top
R18  130.1,83.19 180 bottom
R19  29.21,76.2 0 bottom
R20  114.3,68.58 180 bottom
R21  37.05,33.03 90 bottom
R22  37.07,26.1 90 bottom
R23  105.37,39.09 0 top
R24  111.35,53.01 0 top
R25  108.84,49.91 0 top
R26  109.58,62.92 180 bottom
R27  125.32,78.16 0 bottom
R28  34.06,82.91 0 bottom
R29  75.34,15.27 270 top
R30  1.92,15.05 270 bottom
R31  38.05,14.2 0 top
R32  129.32,33.6 90 top
R33  121.23,33.88 270 top
R34  110.81,30.15 135 top
R35  29.92,63.28 90 bottom
R36  29.91,58.05 90 bottom
R37  15.62,82.18 180 top
R38  17.74,68.3 315 top
R39  15.85,63.98 315 top
R40  9.75,69.56 0 top
RST  99.89,55.54 180 top
SB_LED  68.58,73.66 0 top
SPI  103.85,49.87 270 top
U1  3.63,11 270 bottom
U2  73.41,10.59 270 top
U3  37.15,10.87 270 top
U4  29.26,81.28 0 bottom
U5  130.05,77.47 180 bottom
U6  114.05,64.26 180 bottom
U7  117.35,43.94 45 top
U8  13.17,28.08 270 top
U9  45.12,28.51 270 top
U10  81.37,27.19 270 top
UART  124.82,48.3 270 top
X1  77.47,92.71 0 top
X_LED  55.91,4.99 180 top
X_OUT  44.45,6.35 0 top
X_POT  40.37,25.5 90 top
X_PROBE  55.84,10.11 180 top
Y1  113.23,33.22 135 top
Y_LED  23.89,4.48 180 top
Y_OUT  13.21,6.07 0 top
Y_POT  8.42,29.35 270 top
Y_PROBE  24.04,10.4 180 top

### Tracks (layer width: path | path; a pad name or v marks a point on that pad's centre or on a via)
2B
  Bottom 0.254: R15.1 7.67,11.9 6.95,11.18 4.94,11.18 4.58,11.54 U1.3
  Bottom 2: R15.1 7.67,14.55 3.65,18.58 F2.1A
3V3_CURR_OUT  (via drill 0.35)
  Top 0.254: v126.49,76.47 125.21,75.19 v125.21,61.37 | U7.14 120.14,37.97 v120.17,37.97
  Bottom 0.254: U5.1 128.68,76.45 | 126.49,76.45 v126.49,76.47 | v120.17,37.97 120.17,37.92 122.2,35.89 126.57,35.89 127.89,37.21 127.89,53.01 125.21,55.69 v125.21,61.37
  Bottom 0.5: v126.49,76.47 124.44,76.47 123.9,77.01 R27.2
  Bottom 0.508: 128.68,76.45 126.49,76.45
3V3_IN
  Bottom 3: X1.13 X1.1 X1.2 96.37,87.48 91.44,82.55 | X1.12 54.37,86.6 58.42,82.55 91.44,82.55 | F9.1A 91.44,82.55
5V_CURR_OUT  (via drill 0.35)
  Top 0.254: U7.15 116.26,42.56 v116.26,43.03
  Bottom 0.254: v116.26,43.03 116.26,46.16 116.15,46.27 116.15,47.19 117.47,48.51 117.47,49.35 111,55.83 R26.2
  Bottom 0.5: R26.2 112.04,62.92 112.44,63.31 U6.1
5V_IN
  Top 3: X1.21 66.97,94.19 68.45,92.71 78.74,92.71 | X1.4 87.97,91.47 86.73,92.71 78.74,92.71 | 78.74,92.71 79.57,91.88 X1.6 79.57,87.42 80.84,86.15 80.84,70.29 82.55,68.58 F8.1A
  Bottom 3: X1.21 X1.22 X1.23
9V_CURR_OUT
  Top 0.254: U7.16 121.14,38.38 121.14,37.41 120,36.27 120,26.9 105.46,12.36 76.82,12.36 R29.2
  Top 0.5: 74.36,12.25 75.34,13.23 R29.2
  Top 0.508: U2.1 74.36,12.25
12V_CURR_OUT  (via drill 0.35)
  Top 0.254: U7.17 116.4,43.83 112.64,43.83 110.95,42.14 106.31,42.14 87.85,60.6 48.35,60.6 46.11,62.84 34.11,62.84 v32.44,64.52 | v24.45,79.64 v24.45,75.15
  Bottom 0.254: U4.1 29.78,82.23 28.76,81.21 26.02,81.21 v24.45,79.64 | v24.45,75.15 24.45,72.44 32.37,64.52 v32.44,64.52
  Bottom 0.5: U4.1 30.97,82.23 31.65,82.91 R28.2
+3V3  (via drill 0.35)
  Top 0.254: v117.47,45.97 117.47,47.96 U7.36 119.24,49.72 119.24,50.93 116.45,53.72 PRGM.4 115.09,53.72 114.38,53.01 R24.2 112.15,52.39 112.15,51.13 110.93,49.91 R25.2 | v136.58,44.15 136.55,44.12 133.86,44.12 C23.1 132.77,44.86 C13.+ 128.08,44.86 C17.1 126.49,43.27 C14.1 124.36,42.23 124.09,41.96 123.22,41.96 U7.24 120.91,44.27 v118.87,44.27 113.13,44.27 U7.48 112.45,44.98 111.96,45.47 111.13,45.47 C16.1 110.06,44.4 C15.1 | v117.07,40.66 117.05,40.65 115.82,40.65 U7.9
  Bottom 0.254: v117.47,45.97 117.47,45.95 117.7,45.72 118.24,45.72 118.87,45.09 v118.87,44.27 118.87,42.47 v117.07,40.66 | v136.58,44.15 143.08,44.15 147.32,39.9 | PRGM.4 116.36,55.91 117.85,57.4 C20.1 | C13.+ 128.29,43.16 128.29,34.96 127.42,34.09 BOOT.2 BOOT.1
  Bottom 0.5: U5.4 131.05,78.44 130.72,78.44 130.45,78.71 130.45,82.5 131.14,83.19 R18.2
  Bottom 1: R6.2 147.32,13.97 | 3V3_PROBE.2 147.32,20.55 | 141.26,87.66 142.03,87.66 C35.+ 144.47,85.22 144.47,83.63 144.8,83.96 C36.2 144.8,81.82 3V3_PWR.1 3V3_PWR.3 3V3_PWR.5
  Bottom 3: 3V3_OUT_1.1 147.32,13.97 147.32,20.55 147.32,39.9 147.32,70.73 134.86,83.19 R18.2 136.78,83.19 141.26,87.66 148.84,95.25 3V3_OUT_2.2
+5V  (via drill 0.35)
  Top 0.5: U3.5 38.12,9.82 v38.12,8.6 38.55,8.17 42.79,8.17 44.45,6.5 44.45,5.08 | 29.11,1.98 42.44,1.98 44.45,3.99 44.45,5.08 | v69.39,64.47 51.77,64.47 43.29,72.94 29.6,72.94 | 86.11,4.85 83.64,2.39 53.28,2.39 v51.99,3.67 | 86.11,4.85 86.11,4.8 88.65,2.26 127.99,2.26 5V_OUT_1.1 | 86.11,4.85 86.11,6.81 84.86,8.05 77.29,8.05 | v49.53,4.08 45.45,4.08 44.45,5.08 | v111.81,60.95 110.33,60.95 v110.29,60.98
  Top 0.508: 77.29,8.05 76.63,8.71 C8.1 74.45,9.47 U2.5 | 29.11,1.98 3.06,1.98 2.22,2.82 v2.21,2.82 | 29.6,72.94 25.73,76.81 25.73,82.48 v26.44,83.19
  Bottom 0.254: C7.1 3.29,8.52 2.68,9.13 U1.5
  Bottom 0.5: C10.1 38.12,7.09 v38.12,8.6 | 130.05,75.56 123.81,75.56 R20.2 115.16,68.58 114.5,67.92 114.5,65.5 114.79,65.21 U6.4 | v69.39,64.47 69.39,64.44 98.45,64.44 99.87,63.02 105.28,63.02 107.33,60.97 110.27,60.97 v110.29,60.98 | v51.99,3.67 51.59,4.08 v49.53,4.08 | C7.1 2.41,7.34 1.75,6.68 1.75,3.28 | 116.38,62 115.93,62.46 115.93,62.89 115.5,63.31 U6.5 | C11.1 117.34,63.17 119.8,65.63
  Bottom 0.508: v2.21,2.82 1.75,3.28 | 116.38,62 C11.1 116.29,60.95 v111.81,60.95 | C12.1 133.12,75.61 132.22,76.52 U5.5 130.12,75.56 130.05,75.56 | U4.5 28.21,82.21 27.42,82.21 v26.44,83.19 26.44,84.3 26.96,84.82 C9.1
  Bottom 1: R7.2 130.81,13.97 | 5V_PROBE.2 132.61,20.32 | 130.66,60.71 132.26,62.31 C37.+ 133.64,63.36 C38.2 133.64,66.51 5V_PWR.5 5V_PWR.3 5V_PWR.1
  Bottom 3: 5V_OUT_2.2 128.73,95.25 121.28,87.81 114.48,87.81 111.76,85.09 | 111.76,85.09 111.76,91.01 111.79,91.01 PWR_RES.2 | 111.76,85.09 111.76,79.15 116.48,74.42 116.48,68.92 R20.2 116.85,68.58 119.8,65.63 125.75,65.63 130.66,60.71 132.61,58.76 132.61,20.32 130.81,18.52 130.81,13.97 5V_OUT_1.1
+5VSB
  Top 1: POWER_SB.1 67.31,80.19 66.97,80.53 X1.9
  Bottom 0.5: R10.2 64.92,76.35 66.04,77.47 POWER_SB.1
+9V  (via drill 0.38, 0.51 pad 3)
  Top 0.254: v86.32,8.72 86.42,8.83 93.68,8.83 R4.2 94.81,8.93 9V_PROBE.2
  Top 0.5: R17.2 68.83,9.4 69.6,10.16 71.92,10.16 72.49,9.58 U2.4
  Top 2: v56.13,66.55 56.13,66.65 49.61,73.18 v49.61,74.8 | R17.2 70.1,6.35 9V_OUT_1.1
  Bottom 0.254: 9V_OUT_1.1 86.18,8.71 86.31,8.71 v86.32,8.72
  Bottom 2: v56.13,66.55 56.1,66.51 56.1,57.8 61.98,51.92 61.98,30.52 67.07,25.42 70.84,25.42 78.11,18.16 78.11,14.53 83.77,8.87 83.77,6.4 9V_OUT_1.1 | v49.61,74.8 49.61,78.89 44.13,84.37 38.55,84.37 29.21,93.71 9V_OUT_2.2
+12V
  Bottom 0.5: 12V_PROBE.2 121.06,18.19 115.21,18.19 112.78,15.75 112.78,15.49 | 26.67,76.2 R19.2 27.94,76.2 28.88,77.14 28.88,79.39 U4.4 | 64.86,66.44 64.86,66.1
  Bottom 0.508: Q1.1 24.65,62.88 C34.1 21.85,61.41 21.07,60.63 C5.+
  Bottom 0.762: OUT_FAN.2 9.11,76.48 IN_FAN.2 9.18,77.98 10.6,79.4
  Bottom 1: R8.2 114.3,13.97 | IC1.1 21.38,42.32 C24.2 18.25,45.45 C25.2 18.25,47.28 12.78,52.76 C5.+ 12.78,77.23 10.6,79.4 9.31,80.7 9.31,80.89 | 34.51,69.85 35.21,69.85 39.66,65.4 39.66,65.33 42.16,62.83 C3.+ 42.16,54.27 45.87,50.56 50.46,50.56 52.94,48.08 C32.2 52.98,46.58 C33.2 53.32,43.53 IC2.1 | IC3.1 89.63,41.1 C29.2 88.47,44.42 C28.2 88.31,45.62 85.94,47.98 73.55,47.98 65.55,55.98 C1.+ 65.51,62.59 66.04,63.12
  Bottom 3: 12V_OUT_2.2 7.58,95.21 7.58,82.61 9.31,80.89 12.6,77.6 25.27,77.6 26.67,76.2 | R19.2 26.68,72.91 29.61,69.85 34.51,69.85 61.11,69.85 64.86,66.1 66.04,64.92 66.04,63.12 66.04,61.27 69.24,58.06 86.26,58.06 103.63,40.69 103.63,24.64 112.78,15.49 114.3,13.97 12V_OUT_1.1
+12V_IN
  Top 3: X1.11 X1.10 62.77,78.02 60.49,76.2 F10.1A
BOOT0  (via drill 0.35)
  Top 0.254: R33.1 121.23,36.64 121.84,37.25 121.84,38.04 v121.87,38.04 | v116.81,46.92 116.75,46.92 115.47,45.64 114.59,45.64 U7.44
  Bottom 0.254: v121.87,38.04 121.87,38.37 120.42,39.82 120.42,44.9 118.4,46.92 v116.81,46.92
BOOT1
  Top 0.254: R32.2 129.32,35.97 128.84,36.45 125.08,36.45 121.49,40.03 121.49,40.86 U7.20
CUT
  cutout Bottom: 0.41,17.42 0.41,9.73 1.35,8.79 9.22,8.79 9.6,9.17 9.6,14.12 8.96,14.77 5.78,14.77 3.56,16.99 3.56,17.45 2.97,18.03 1.02,18.03
CUTOUT
  cutout Bottom: 27.03,82.96 27.03,79.6 25.58,78.16 25.58,75.01 26.47,74.12 32.08,74.12 32.89,74.93 32.89,78.21 30.96,78.21 30.96,80.59 36.12,80.59 36.96,81.43 36.96,83.92 36.27,84.61 31.88,84.61 31.8,84.53 28.7,84.53 27.13,82.96
  cutout Bottom: 122.89,78.89 122.89,76.56 124,75.44 131.85,75.44 131.85,78.69 131.11,79.43 131.11,80.9 131.39,81.18 133.48,81.18 134.04,81.74 134.04,84.63 133.02,85.65 127.15,85.65 126.39,84.89 126.39,81.74 126.26,81.61 126.8,81.08 127.64,81.08 128.04,80.67 128.04,79.96 127.41,79.32 123.32,79.32
  cutout Bottom: 106.12,62.79 107.31,61.59 112.5,61.59 113.51,62.61 115.77,62.61 115.98,62.81 115.98,65.89 116.28,66.19 117.55,66.19 118.19,66.83 118.19,70.36 117.5,71.04 111.05,71.04 110.26,70.26 110.26,67.21 110.85,66.62 112.42,66.62 112.47,66.67 112.93,66.22 113,66.22 113,65.3 112.47,64.77 106.32,64.77 106.12,64.57
  cutout Top: 30.66,13.31 30.66,8.27 31.75,7.18 31.78,7.2 34.56,7.2 35.42,8.06 35.42,8.84 35.67,9.09 38.46,9.09 38.53,9.02 38.89,9.37 38.89,11.47 38.9,11.48 38.9,12.22 39.67,12.99 40.54,12.99 40.87,13.32 40.87,15.13 40.49,15.51 35.62,15.51 35.18,15.06 35.18,15.01 31.23,15.01 30.66,14.44 30.66,13.28
GND  (via drill 0.35, 0.35 pad 3, 0.38, 0.5, 0.51, 1)
  Top 0.254: RST.1 101.16,58.71 98.45,61.42 | v118.16,43.56 118.19,43.54 120.94,43.54 U7.23 121.91,42.58 124.01,40.47 C14.2 126.49,40.47 C17.2 129.28,40.5 C13.- 132.31,39.78 C23.2 137.54,41.15 137.9,41.5 138,41.4 | v116.28,41.43 115.89,41.43 U7.8 | 103.56,58.88 104.85,57.58 I2C.3 104.85,53.82 105.78,52.9 105.78,45.72 v105.74,45.68 | 126.16,58.88 124.87,57.58 123.98,56.69 PRGM.1 124.82,52.88 UART.1 123.85,49.87 120.07,49.87 118.71,48.51 U7.35 118.14,47.91 118.14,45.16 v117.98,45.01 117.69,44.72 113.39,44.72 U7.47 110.86,47.25 C16.2 107.97,47.25 C15.2 | v141.94,72.8 141.94,72.77 143.74,70.97 143.74,65 | U3.2 37.15,12.85 36.63,13.37 R31.1 36.63,16.69 45.12,25.18 U9.1 | C8.2 79.43,10.5 78.82,11.11 v77.83,11.11 | BOOT.6 BOOT.5 122.07,26.87 122.07,24.69 | Q3.S R40.1 8.33,68.01 v7.21,66.89 | R37.1 20.9,82.18 21.09,82.37 | Q2.S 11.21,87.26 15.11,91.16
  Top 0.5: 12.7,92.71 12V_OUT_2.1 | v73.66,73.66 77.47,73.66 | v73.41,8.38 U2.2 73.41,16.31 73.79,16.69 R29.1
  Top 0.508: v122.71,61.44 124.87,59.28 124.87,58.84 124.87,57.58 | C5.- 7.7,60.2 9.59,58.3 16.98,58.3 v17.07,58.39
  Top 1: 12V_PROBE.1 12V_LED.1 125.73,11.43 12V_OUT_1.2 | 5V_LED.1 5V_PROBE.1 151.26,28.07 151.92,28.73 | 3V3_LED.1 157.43,14.02 3V3_PROBE.1 157.43,28.5 153.06,32.87 151.28,32.87 | 116,12.19 119.28,8.91 | PS_STAT_LED.2 45.87,84.2 44.09,82.42 v38.15,82.42 | 10.77,43.76 D2.A | C35.- 151.13,88.52 151.13,88.9 | C37.- 138.71,61.27 138.71,59.97
  Top 2: 7.4,47.9 C4.- | 5.44,44.88 C26.1 7.4,47.15 | U8.2 23.33,28.04
  Top 2.5: C27.1 5.44,44.88
  Top 3: 3V3_OUT_2.1 154.94,92.71 151.13,88.9 | 144.78,88.9 5V_OUT_2.1 | 151.13,88.9 144.78,88.9 | 81.53,62.48 76.2,67.82 v76.2,86.36 | 81.53,62.48 97.38,62.48 98.45,61.42 100.96,58.9 105.12,58.9 | 138.71,47.73 138.71,59.97 143.74,65 151.28,72.54 | 151.28,72.54 151.28,32.87 151.26,32.84 151.26,28.07 151.26,9.93 152.4,8.79 3V3_OUT_1.2 | 138.71,47.73 127.6,58.84 124.87,58.84 | PWR_RES.1 126.64,88.9 144.78,88.9 | 12V_OUT_1.2 119.28,5.18 119.28,8.91 119.28,21.89 122.07,24.69 133.63,24.69 137.67,28.73 | 137.67,28.73 137.67,40.28 138.71,41.33 138.71,47.73 | 137.67,28.73 137.67,6.86 5V_OUT_1.2 | 9V_OUT_2.1 34.29,92.08 31.32,89.1 21.09,89.1 | 12V_OUT_2.1 12.7,93.57 15.11,91.16 17.17,89.1 21.09,89.1 | 81.53,62.48 70.28,62.48 70.23,62.44 50.55,62.44 45.72,67.26 26.28,67.26 21.09,72.44 21.09,82.37 21.09,89.1 | 103.56,58.88 126.16,58.88 | 151.28,72.54 151.28,88.75 151.13,88.9 | D2.A 10.77,34.06 15.75,29.08 Y_OUT.2
  Top 4: D2.A 7.4,47.9 | IC1.3 IC1.5 10.77,43.76 | 7.4,47.15 C4.-
  Bottom 0.254: v117.98,45.01 118.16,44.83 v118.16,43.56 118.16,42.7 116.89,41.43 v116.28,41.43 114.41,41.43 113.06,42.79 108.43,42.79 107.05,41.4 107.05,38.67 108.32,37.4 109.23,37.4 v109.4,37.57 | 126.77,78.46 R27.1 126.85,78.26 127.79,78.26 128.57,77.47 U5.2 131.81,77.47 132.75,78.41 C12.2 136.3,78.41 141.94,72.77 | BOOT.5 124.78,29.01 | C20.2 122.84,57.4 123.98,56.26 PRGM.1 | 141.95,72.76 141.94,72.77 | 141.94,72.77 v141.94,72.8 | Y_LED.1 23.36,2.68 19.14,2.68 Y_OUT.2 | IC1.3 17.98,35.34 19.09,34.24 R12.1 19.09,32.36 U8.2 | R22.1 37.07,22.26 42.22,17.12 46.99,17.12 | v73.41,8.38 75.75,8.38 76.87,9.5 76.87,10.65 77.33,11.11 v77.83,11.11 | LED1.K 96.1,35.75 96.1,32.78 91.57,28.25 U10.2 | v7.21,66.89 7.21,61.11 C5.-
  Bottom 0.5: v73.66,73.66 SB_LED.2 POWER_SB.2 71.12,78.74 83.82,78.74 | 3.71,11.94 U1.2 | U4.2 35.15,81.28 35.56,81.69 35.56,82.83 R28.1 | PS_SWITCH.2 95.53,71.22 102.49,64.26 105.82,64.26 | v73.41,8.38 73.41,5.84 75.44,3.81 61.47,3.81 | U6.2 105.82,64.26 | U1.2 3.63,15.75 2.91,16.47 R30.1 | U1.2 3.63,9.64 | v122.71,61.44 122.15,62 C11.2 | R26.1 107.16,62.92 105.82,64.26 | 10.77,43.05 D2.A | R9.1 53.66,33.63 55.32,31.96 U9.2 | C28.1 85.67,44.42 C29.1 84.3,40.9 IC3.3
  Bottom 0.508: 75.44,3.81 86.36,3.81 9V_OUT_1.2 | C7.2 4.28,4.54 5.02,5.28 5.02,8.29 4.6,8.71 4.25,8.71 3.63,9.33 3.63,9.64 | C10.2 44.76,4.12 X_OUT.2 | R14.1 10.2,42.48 10.77,43.05 | 61.47,3.81 58.36,3.81 X_LED.1 57.17,10.05 X_PROBE.1 | R36.1 25.5,56.63 23.83,58.3 17.16,58.3 v17.07,58.39 | Q1.3 24.39,65.42 C34.2 | 83.82,78.74 87.58,74.98 PS_SWITCH.2 | C9.2 34.11,84.82 36.13,82.8
  Bottom 1: X1.19 73.04,97.79 56.7,97.79 X1.24 53.48,95.46 50.92,98.02 37.06,98.02 9V_OUT_2.1 | R28.1 35.59,82.8 36.13,82.8 37.31,82.8 37.69,82.42 v38.15,82.42 | Y_PROBE.1 25.31,4.64 Y_LED.1 | 17.98,40.22 IC1.3 17.88,40.05 C24.1 15.45,45.45 C25.1 | 9V_LED.1 98.82,5.33 9V_PROBE.1 98.82,19.94 U10.2 91.57,29.44 R13.1 | IC2.3 50.17,40.57 C33.1 50.17,46.58 C32.1 | 3V3_PWR.6 3V3_PWR.4 3V3_PWR.2 147.47,83.94 C36.1 147.6,84.99 C35.- | 5V_PWR.2 5V_PWR.4 5V_PWR.6 136.44,66.48 C38.1 136.45,63.26 137.4,62.31 C37.-
  Bottom 2: U9.2 U9.1 | C31.1 36.03,40.45 C30.1 36.03,44.2 C2.- | C21.1 C22.1 70.67,42.59 C6.-
  Bottom 3: X1.15 X1.3 92.17,88.72 90.42,86.97 84.48,86.97 83.82,87.63 83.82,89.91 X1.5 83.77,95.2 83.82,95.25 83.82,95.41 X1.17 X1.18 X1.19 X1.7 75.37,88.46 76.2,87.63 v76.2,86.36 | C4.- 7.53,51.78 7.53,60.47 C5.- | D1.A 42.99,30.64 U9.1 46.99,26.64 46.99,17.12 X_OUT.2 | 78.55,43.25 D3.A 78.55,30.01 U10.1 88.9,19.66 9V_OUT_1.2 | 71.89,43.36 C6.-
  Bottom 4: IC2.3 IC2.5 46.52,40.95 43.06,44.41 D1.A 42.67,44.73 39.46,44.73 38.21,45.97 C2.- 37.81,46.39 35.87,48.34 35.87,54.39 C3.- | IC3.3 IC3.5 78.55,43.25 | D3.A 71.89,43.36 | C6.- 71.67,43.93 65.51,50.09 C1.-
  other vias: 61.77,55.24 113.67,61.82 109.42,3.37 65.38,85.6 38.58,64.95 130.15,50.27 127.34,60.91 118.64,77.36 124.89,80.52 117.2,64.67 109.45,65.79 125.93,37.44 60.52,66.66 21.15,45.72 73.55,66.93 62.28,72.87 30.75,40.98 30.84,51.74 105.82,10.49 70.48,54.98 45.69,65.04 100.33,52.08 108.53,28.11 113.12,33.13 115.94,27.76 117.63,37.34 142.16,82.77 34.34,3.71
  pour Bottom: -1.09,103.61 -1.09,2.11 2.54,-1.52 163.22,-1.52 163.22,103.61
  pour Top: -1.13,100.98 -1.13,-2.25 155.47,-2.25 164.85,7.12 164.85,103.63 1.52,103.63
  cutout Top: 66.86,6.77 75.03,6.77 75.03,10.06 76.99,12.01 76.99,17.6 76.53,18.06 74.08,18.06 70.04,14.02 66.93,14.02
I2C_SCL  (via drill 0.35)
  Top 0.254: I2C.1 R24.1 109.93,52.95 109.93,51.94 110.5,51.37 v111.46,51.37 | U7.42 113.91,47.73 112.75,47.73 112.06,48.42 v112.06,50.05
  Bottom 0.254: v111.46,51.37 112.05,50.77 112.05,50.06 v112.06,50.05
I2C_SDA
  Top 0.254: R25.1 107.39,49.94 | 107.39,49.94 107.39,49.84 108.56,48.67 111.06,48.67 112.4,47.33 113.61,47.33 U7.43 | I2C.2 107.39,49.94
IN_FAN_PWM  (via drill 0.35)
  Top 0.254: v33.01,59.44 31.57,59.44 31.09,58.95 26.05,58.95 23.22,61.78 23.22,65.98 D4.C 20.72,66.06 19.98,66.06 R38.2 | v37.39,59.09 37.99,59.69 45.48,59.69 47.44,57.73 87.19,57.73 96.66,48.27 96.66,27.04 105.64,18.06 109.73,18.06 113.67,22 113.67,22.62 v114.16,23.11 | U7.21 122.49,40.57 122.49,39.66 123.46,38.68 128.55,38.68 130.66,36.57 130.66,29.74 v130.06,29.15
  Bottom 0.254: v37.39,59.09 37.41,59.07 36.38,58.05 35.68,58.05 34.29,59.44 v33.01,59.44 | v130.06,29.15 124.03,23.11 v114.16,23.11
N$1
  Top 2: IC3.2 91.33,35.07 93.79,37.53 D3.C 93.79,46.51 87.27,53.02 L3.1
N$2
  Top 0.254: IC3.4 81.17,31.7 76.18,31.7 R1.E
  Bottom 1: IC3.4 84.53,32.95 85.08,32.41 R13.2
N$3  (via drill 0.35)
  Top 0.254: U7.5 112.27,39.92 v112.27,39.29 | Y1.2 110.99,34.39 109.82,34.39 C18.1 109.8,31.48 R34.2
  Bottom 0.254: v112.27,39.29 112.27,35.67 Y1.2
N$4
  Top 2: IC2.2 51.64,36.4 53.56,36.4 58.23,41.07 D1.C 58.23,52.23 L1.1
N$5  (via drill 0.35)
  Top 0.254: U7.6 113.46,40.41 113.46,39.4 v113.49,39.37 | Y1.1 114.94,29.07 C19.1 111.81,29.07 R34.1
  Bottom 0.254: v113.49,39.37 113.49,35.15 114.94,33.7 Y1.1
N$6
  Bottom 0.5: U6.3 113.51,65.21 113.79,65.5 113.79,67.97 113.18,68.58 R20.1
  Bottom 3: F8.2A R20.1
N$7
  Bottom 0.508: R3.1 20.85,4.48 Y_LED.2
N$8
  Bottom 0.508: X_LED.2 52.73,4.99 52.13,5.59 R2.1
N$9
  Top 0.508: R4.1 94.54,5.32 9V_LED.2
N$10
  Top 0.254: C19.2 110.81,24.94 109.3,24.94 105.89,28.35 105.89,30.47 C18.2
N$11
  Bottom 1: R6.1 3V3_LED.2
N$12
  Bottom 1: 5V_LED.2 R7.1
N$13
  Bottom 1: 12V_LED.2 R8.1
N$14
  Bottom 0.5: SB_LED.1 67.16,73.51 R10.1
N$15
  Bottom 0.5: PS_STAT_LED.1 43.33,89.89 43.74,90.3 R11.1
N$16
  Top 0.254: BOOT.4 128.69,31.55 R32.1
N$17
  Top 0.254: F6.2A 72.12,33.17 72.12,30.04 73.93,28.23 R1.S
  Top 2: L3.2 75.31,53.29 73.14,53.29 66.59,46.73 C6.+
  Bottom 2: F6.2A 67.87,37.43 C21.2 C22.2 67.87,42.31 C6.+
N$18
  Top 2: IC1.2 19.73,36 22.09,36 26.01,39.92 D2.C 27.62,46.15 27.62,53.98 L2.1
N$19
  Bottom 0.5: R18.1 129.05,83.19 129.74,82.49 129.74,78.71 129.46,78.42 U5.3
  Bottom 3: R18.1 122.81,83.19 F9.2A
N$20
  Top 0.254: R16.1 33.29,11.73 33.88,11.14 36.01,11.14 36.2,11.33 U3.3
  Top 2: F1.2A R16.1
N$21
  Bottom 0.5: R19.1 30.62,76.2 29.7,77.13 29.7,79.34 30.29,80.13 U4.3
  Bottom 3: R19.1 F10.2A
N$23
  Top 0.5: R17.1 69.09,12.96 69.09,11.43 69.6,10.92 72.14,10.92 72.55,11.34 U2.3
  Top 2: F6.1A 68.83,15.63 R17.1
N$25  (via drill 0.35)
  Top 0.254: U7.7 115.41,41.65 115.41,42.33 114.99,42.75 v114.99,42.76
  Bottom 0.254: v114.99,42.76 114.39,43.36 105.56,43.36 98.61,50.3 RST.2
N$26
  Bottom 0.508: R35.2 28.19,64.71 Q1.2
N$27
  Top 0.254: U7.2 111.28,41.05 111.28,40.79 110.57,40.08 109.18,40.08 108.19,39.09 R23.2
N$28
  Top 0.254: R23.1 102.01,39.09 101.28,38.27 LED1.A
N$29
  Top 0.254: BOOT.3 122.15,31.55 R33.2
N$30
  Top 0.254: R38.1 15.76,70.28 15.76,71.89 D4.A 16.53,78.81 14.2,81.14 R37.2 12.55,83.83 4.95,83.83 3.31,82.19 Q2.G
N$31
  Bottom 0.762: IN_FAN.1 6.64,79.84 5.37,81.11 5.37,84.11 4.77,84.72 Q2.D
N$32
  Top 0.254: R39.1 14.21,65.62 14.21,66.64 15.01,67.44 D5.A 13.6,69.56 11.34,69.56 | 10.5,69.56 R40.2 11.34,69.56 | 11.34,69.56 11.34,68.14 7.7,64.49 Q3.G
N$35
  Bottom 0.762: Q3.D 4.74,67.03 6.57,68.86 OUT_FAN.1
OUT_FAN_PWM  (via drill 0.35)
  Top 0.254: v34.58,57.4 34.58,57.47 37.45,60.34 45.6,60.34 47.76,58.18 87.34,58.18 97.07,48.46 97.07,27.2 105.42,18.85 109.28,18.85 v112.67,22.24 | U7.22 122.91,40.85 122.91,39.82 123.58,39.15 128.65,39.15 129.27,38.53 129.3,38.53 131.06,36.77 131.06,29.08 v129.84,27.86 | v31.98,58.46 24.7,58.46 D5.C 19.84,62.2 17.63,62.2 R39.2
  Bottom 0.254: v31.98,58.46 33.25,57.19 34.37,57.19 v34.58,57.4 | v129.84,27.86 129.45,27.47 129.21,27.47 124.12,22.38 112.74,22.38 112.67,22.31 v112.67,22.24
PG
  Bottom 0.5: X1.8 68.42,92.71 52.07,92.71 49.66,90.3 R11.2
PS_ON
  Top 0.5: X1.16 90.17,93.26 90.17,85.98 98.07,78.08 PS_SWITCH.1
RX_PIN
  Top 0.254: UART.2 121.35,48.3 U7.31
SPI_MISO  (via drill 0.35)
  Top 0.254: U7.40 113.98,49.07 113.7,49.07 v113.7,49.06
  Bottom 0.254: v113.7,49.06 v113.69,49.07 112.74,49.07 111.54,47.87 107.11,47.87 106.22,48.75 106.22,49.52 105.87,49.87 SPI.2
SPI_MOSI  (via drill 0.35)
  Top 0.254: U7.41 113.95,48.4 v113.06,48.4
  Bottom 0.254: v113.06,48.4 112.73,48.4 111.77,47.43 103.95,47.43 SPI.3
SPI_SCK  (via drill 0.35)
  Top 0.254: U7.39 113.88,49.89 v113.08,49.89
  Bottom 0.254: v113.08,49.89 112.89,49.89 111.28,48.28 107.26,48.28 106.67,48.88 106.67,51.3 105.55,52.41 SPI.1
SWCLK  (via drill 0.35)
  Top 0.254: PRGM.2 121.44,52.7 v120.45,51.71 | v117.84,50.71 116.73,50.71 115.85,49.84 115.85,49.33 U7.37
  Bottom 0.254: v120.45,51.71 120.4,51.71 119.39,50.71 v117.84,50.71
SWDIO  (via drill 0.35)
  Top 0.254: PRGM.3 118.9,52.15 120.4,50.65 v120.4,50.57 | v120.37,49.17 120.12,48.92 119.86,48.92 U7.34
  Bottom 0.254: v120.4,50.57 120.4,49.2 v120.37,49.17
TEMP_SENS  (via drill 0.35)
  Top 0.254: v38.25,61.21 45.87,61.21 47.97,59.12 87.55,59.12 105.72,40.96 105.72,38.07 106.73,37.06 106.73,32.22 113.33,25.62 116.99,25.62 118.77,27.39 v118.77,29.16 | U7.18 122.69,38.24 v122.69,32.77
  Bottom 0.254: 29.48,62.1 30.37,61.21 v38.25,61.21 | v122.69,32.77 122.69,31.04 121.64,29.98 119.27,29.98 118.77,29.49 v118.77,29.16
  Bottom 0.508: R36.2 29.91,61.67 | 29.91,61.67 29.48,62.1 | R35.1 29.92,61.66 29.91,61.67
TX_PIN
  Top 0.254: U7.30 121.36,47.6 123.06,47.6 124.82,45.85 UART.3
VDD  (via drill 0.51)
  Top 0.254: R16.2 33.29,10.11 33.85,10.67 35.94,10.67 36.2,10.4 U3.4
  Top 0.508: v49.72,12.69 44.08,12.69 v44.08,12.65
  Top 2: R16.2 33.47,8.73 36.06,6.13 36.2,6.17 41.73,6.17 X_OUT.1
  Bottom 0.508: X_PROBE.2 53.21,10.11 R2.2 52.13,10.68 50.13,12.69 v49.72,12.69 | v44.08,12.65 43.79,12.36 43.79,8 42.14,6.35 X_OUT.1
VSS
  Bottom 0.254: R15.2 7.67,9.96 6.92,10.71 4.98,10.71 4.58,10.31
  Bottom 0.5: U1.4 4.58,10.31 | 14.91,8.18 12.8,6.07 Y_OUT.1
  Bottom 0.508: Y_PROBE.2 22.23,10.4 R3.2 14.91,8.18
  Bottom 2: Y_OUT.1 8.7,6.07 7.58,7.19 7.58,8.13 R15.2
X_CURR_OUT  (via drill 0.35)  (1 unrouted)
  Top 0.254: U7.12 115.77,38.48 115.77,37.13 118,34.91 v118,29.87 | v102.68,1.47 102.44,1.23 53.33,1.23 51,3.56 51,5.87 46.63,10.24 39.1,10.24 38.1,11.23 U3.1 38.11,13.04 39.47,13.89 R31.2 | v103.72,7.3 103.72,9.51 118.05,23.84 v118.05,23.86
  Bottom 0.254: 108.37,14.17 108.37,10.35 | v118,29.87 118.05,29.82 v118.05,23.86 | v102.68,1.47 102.7,1.47 103.72,2.49 v103.72,7.3
X_POT_2
  Top 2: L1.2 45.14,54.15 40.89,49.91 36.59,49.91 32.73,46.05 C2.+
  Bottom 0.254: R21.2 37.76,34.45 38.52,33.69 38.52,26.73 39.75,25.5 X_POT.2
  Bottom 1: R21.2 33.41,38.09 F1.1A
  Bottom 2: F1.1A 33.26,38.12 33.26,40.2 33.26,40.21 C31.2 33.23,40.45 C30.2 33.21,42.69 33.21,43.98 32.73,44.46 C2.+
X_POT_3  (via drill 1)
  Top 0.5: v47.6,33.6 44.84,33.6 40.37,29.13 X_POT.3
  Bottom 0.5: R9.2 48.22,35.06 IC2.4
  Bottom 0.508: R9.2 49.65,33.62 47.6,33.62 v47.6,33.6
X_VOLT_OUT  (via drill 0.35, 0.38)
  Top 0.254: v108.37,40.48 106.79,40.48 87.58,59.69 47.97,59.69 45.78,61.88 37.51,61.88 29.59,53.96 29.59,32.7 32.05,30.24 v32.09,30.24 | U7.10 114.26,38.38 110.49,38.38 109.5,39.37 v109.5,39.4
  Bottom 0.254: v108.37,40.48 108.43,40.48 109.47,39.43 109.47,39.42 v109.5,39.4 | v32.09,30.24 33.24,29.1 37.07,29.1
  Bottom 1: R21.1 37.07,31.59 37.07,29.1 R22.2
Y_CURR_OUT  (via drill 0.35)
  Top 0.254: U7.13 119.51,37.89 119.51,27.22 105.33,13.04 v104.76,13.04
  Bottom 0.254: v104.76,13.04 v104.76,13.03 103.21,13.03 102.73,12.55 102.73,2.69 101.84,1.8 1.47,1.8 1.18,2.1 1.18,10.07 2.63,11.52 U1.1
  Bottom 0.5: R30.2 2.02,13.52 2.02,13.27 2.68,12.61 U1.1
Y_POT_2
  Top 2: L2.2 9.97,54.6 9.58,54.99 4.42,54.99 2.32,52.9 C4.+ 2.32,45.2 C26.2 2.49,42.76 C27.2 2.56,42.53 2.56,41.96 3.65,40.88 F2.2A
  Bottom 0.254: F2.2A 3.65,38.1 6.55,35.19 6.55,30.58 7.79,29.35 Y_POT.2
  Bottom 0.508: R5.2 4.53,48.72 2.32,50.93 C4.+
Y_POT_3
  Bottom 0.5: IC1.4 16.28,33.19 R12.2 14.87,33.15 8.53,26.81 Y_POT.3
Y_VOLT_OUT  (via drill 0.35, 0.38)
  Top 0.254: v110.07,40.74 109.08,41.73 106.12,41.73 87.71,60.15 48.16,60.15 45.96,62.34 37.06,62.34 31.85,57.14 v31.79,57.14 | U7.11 114.2,37.62 111.66,37.62 v111.61,37.67 | v12.08,48.91 15.05,48.91 16.7,50.56 20.69,50.56 v20.7,50.55
  Bottom 0.254: v111.61,37.67 111.61,37.74 110.54,38.81 110.54,40.26 110.07,40.73 v110.07,40.74 | v12.08,48.91 10.15,48.91 4.98,43.74 4.53,43.74 | v20.7,50.55 20.78,50.62 27.09,50.62 31.79,55.32 v31.79,57.14
  Bottom 0.508: R5.1 4.53,43.74 4.53,42.8 R14.2

### Text on the board
tNames: - | + | - | - | + | - | + | - | + | + | + | - | + | - | + | - | + | - | - | + | + | - | ATX Desktop / Power Supply Board V1 | + | - | SCL | SDA | - | SWCLK | + | - | SWDIO | 3v3 | SCK | - | MISO | RX | MOSI | TX | Scott Gibb | + | - | + | - | + | - | - | + | - | + | - | - | + | + | - | - | + | - | + | - | + | - | + | - | - | - | + | - | + | - | + | + | + | - | + | +